# EasyEDA Pro project ProPrj_ETHlink8xADC_2025-03-31.epro, schematic ETHlink8xADC_Schematic, sheets 1 to 5 of 13

## Sheets
1 PSU: Board Name: ETHlink8xADC; Create Date: 2024-06-26; Page Name: PSU; Project Name: ETHlink8in; Schematic Name: ETHlink8xADC_Schematic; Update Date: 2024-06-27; Company: EasyEDA.com; Drawn: Eugenio Mancini; Page Size: A4; Part Number: JLCPCB-002; Reviewed: EasyEDA; Version: V1.0
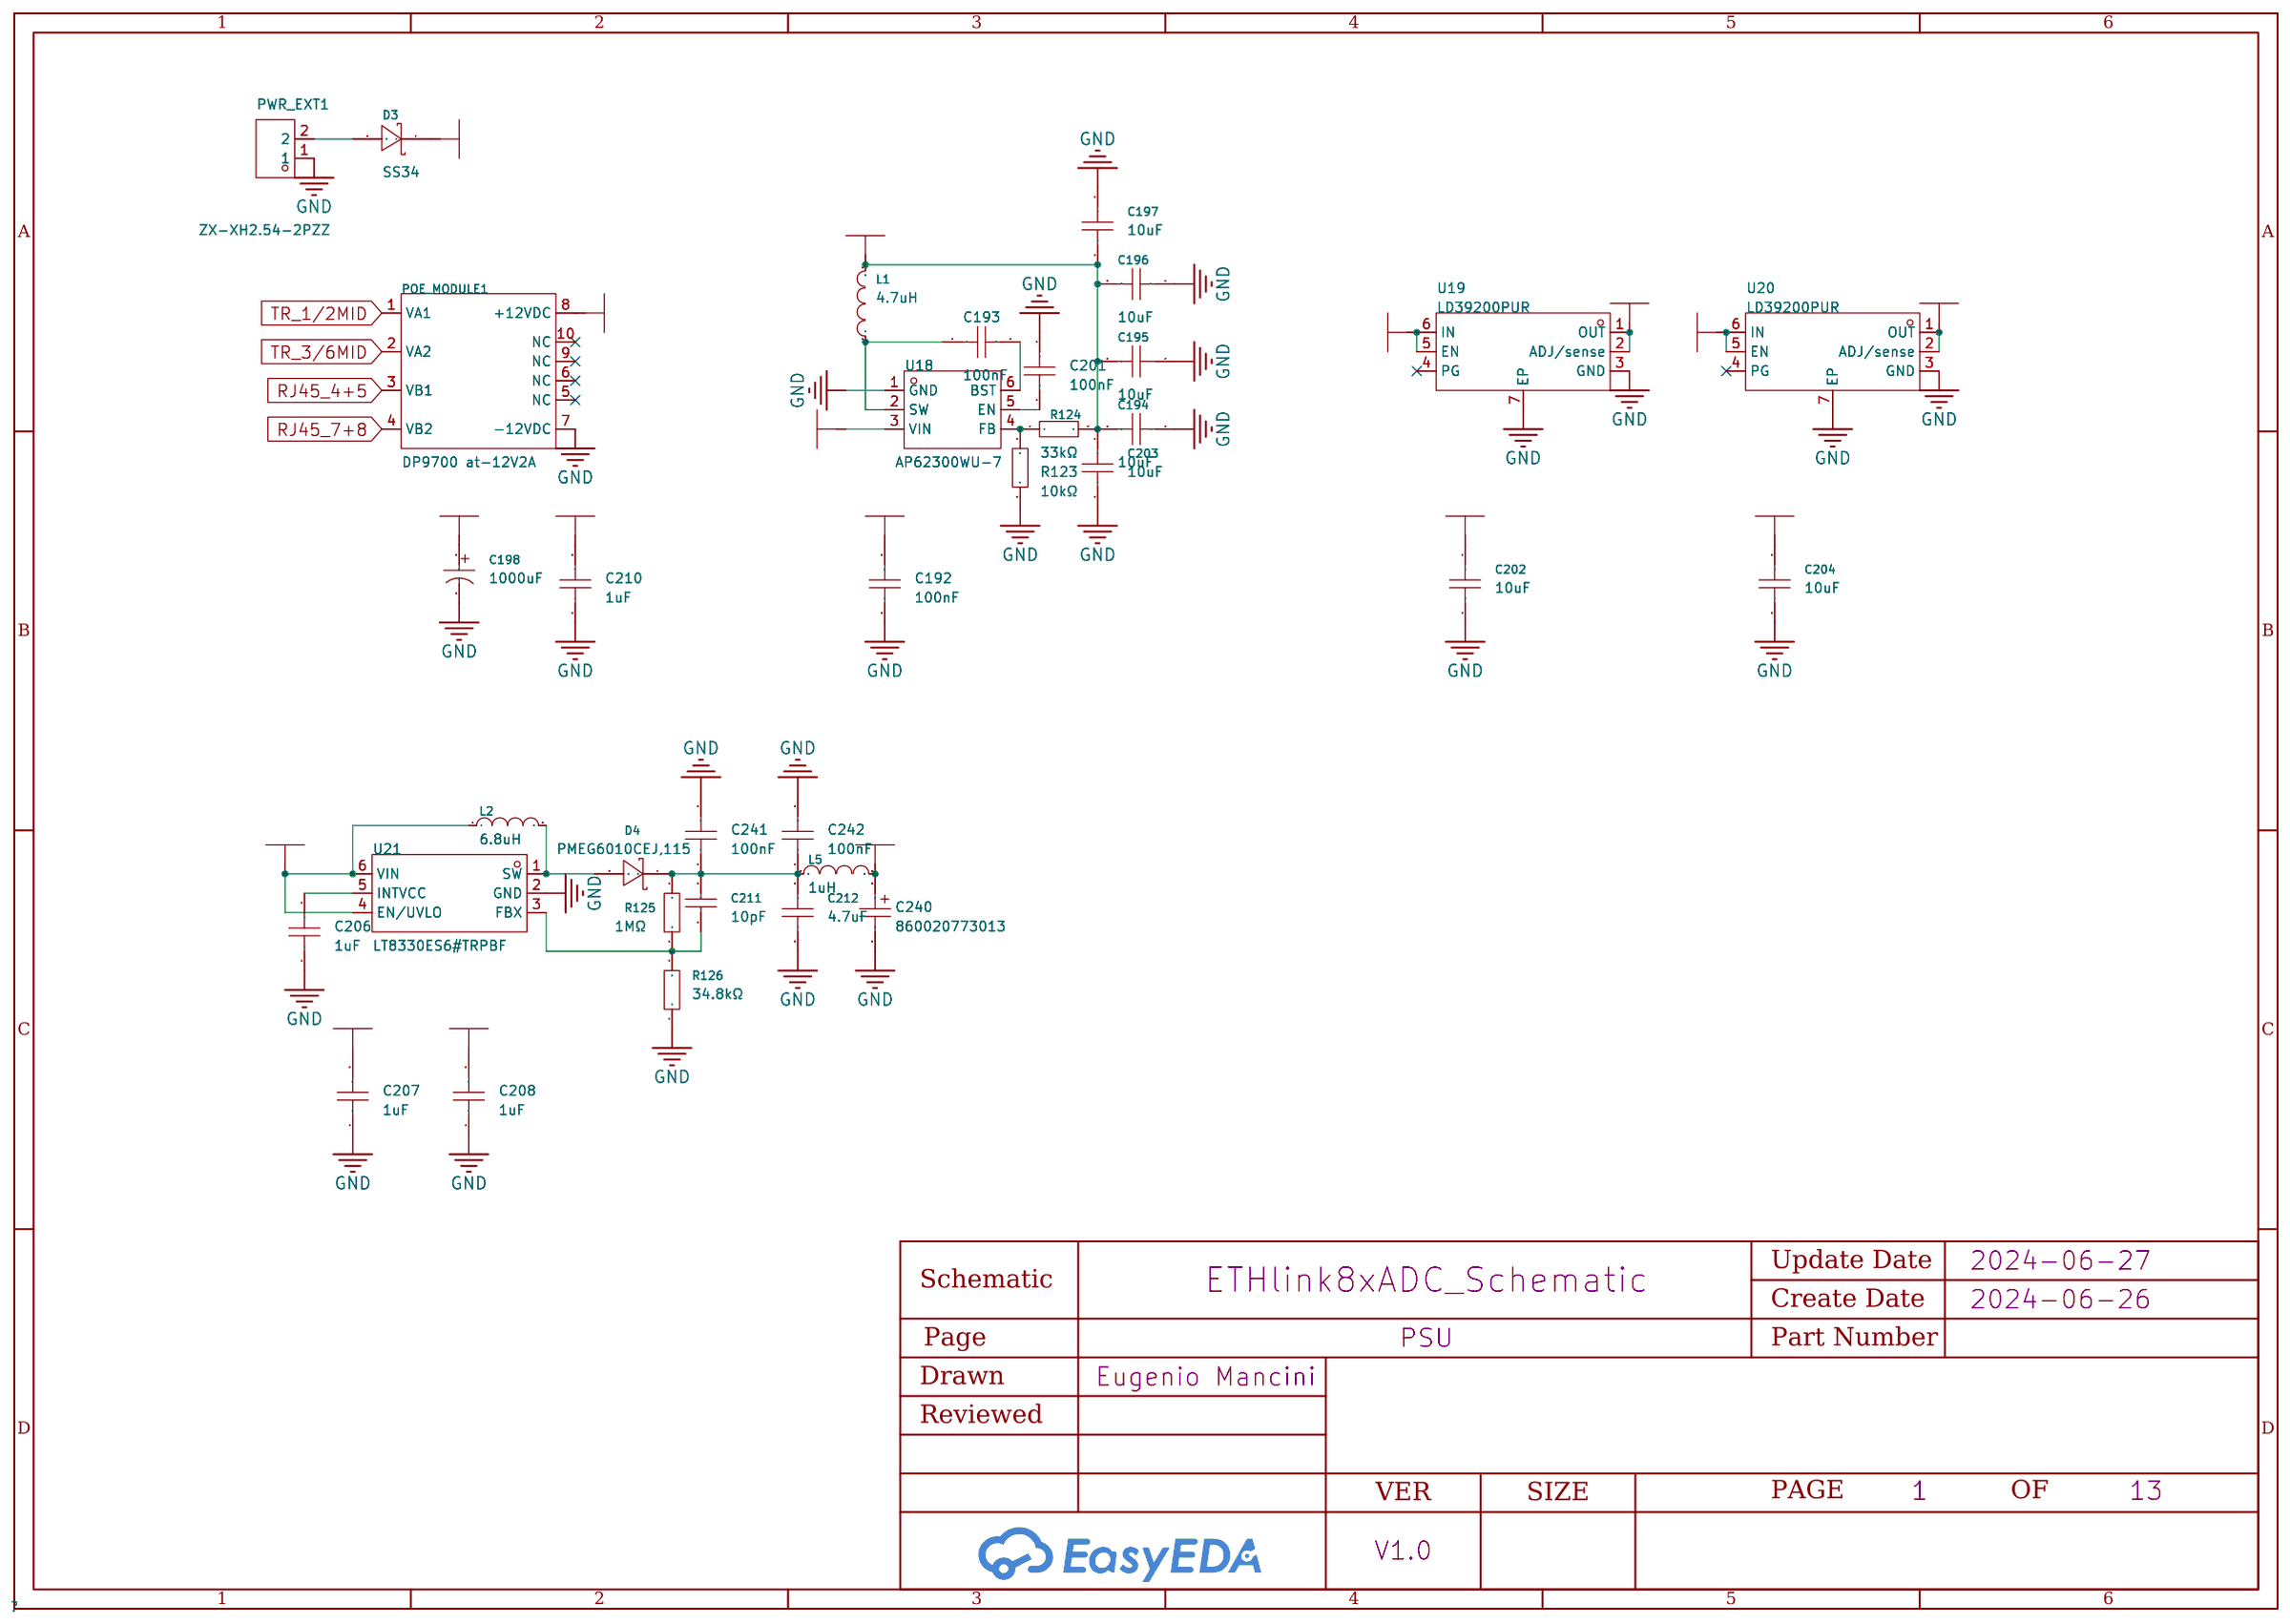
[diagram p0: PSU]
2 MCU: Page Name: MCU; Update Date: 2025-03-01
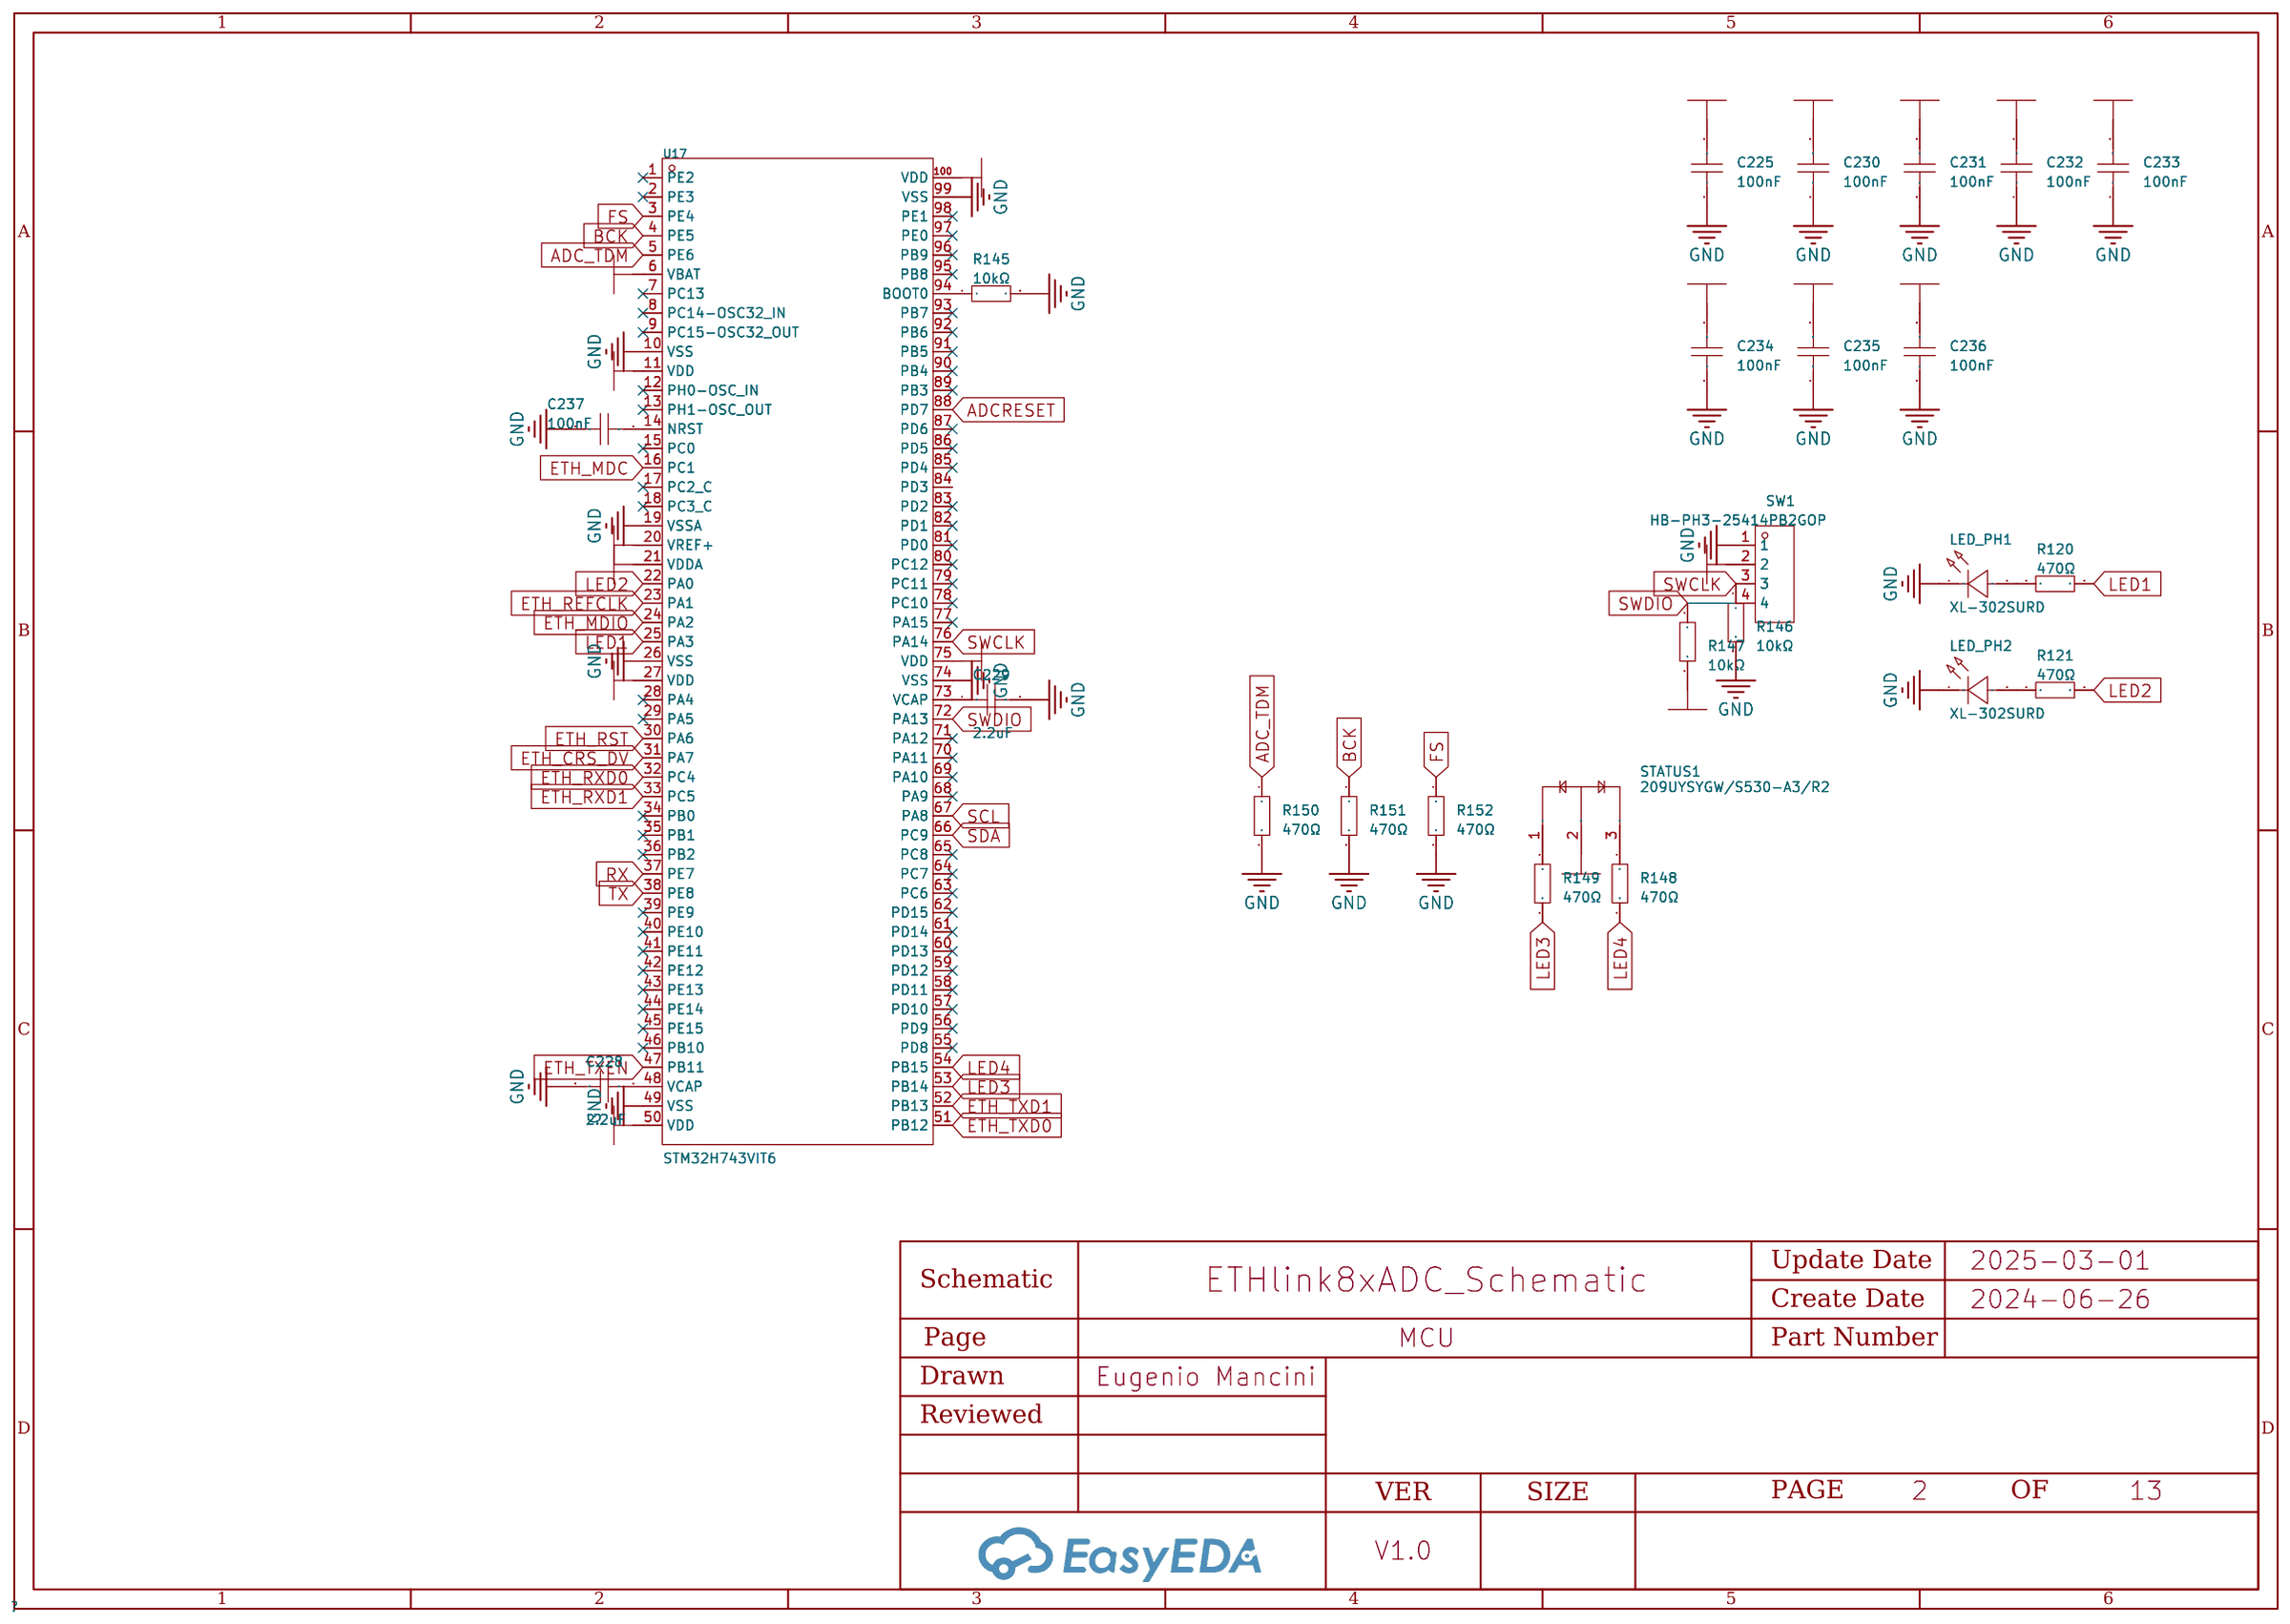
[diagram p1: MCU]
3 ETHERNET_PHY: Page Name: ETHERNET_PHY; Update Date: 2025-03-01; Drawn: EasyEDA; Version: V0.1
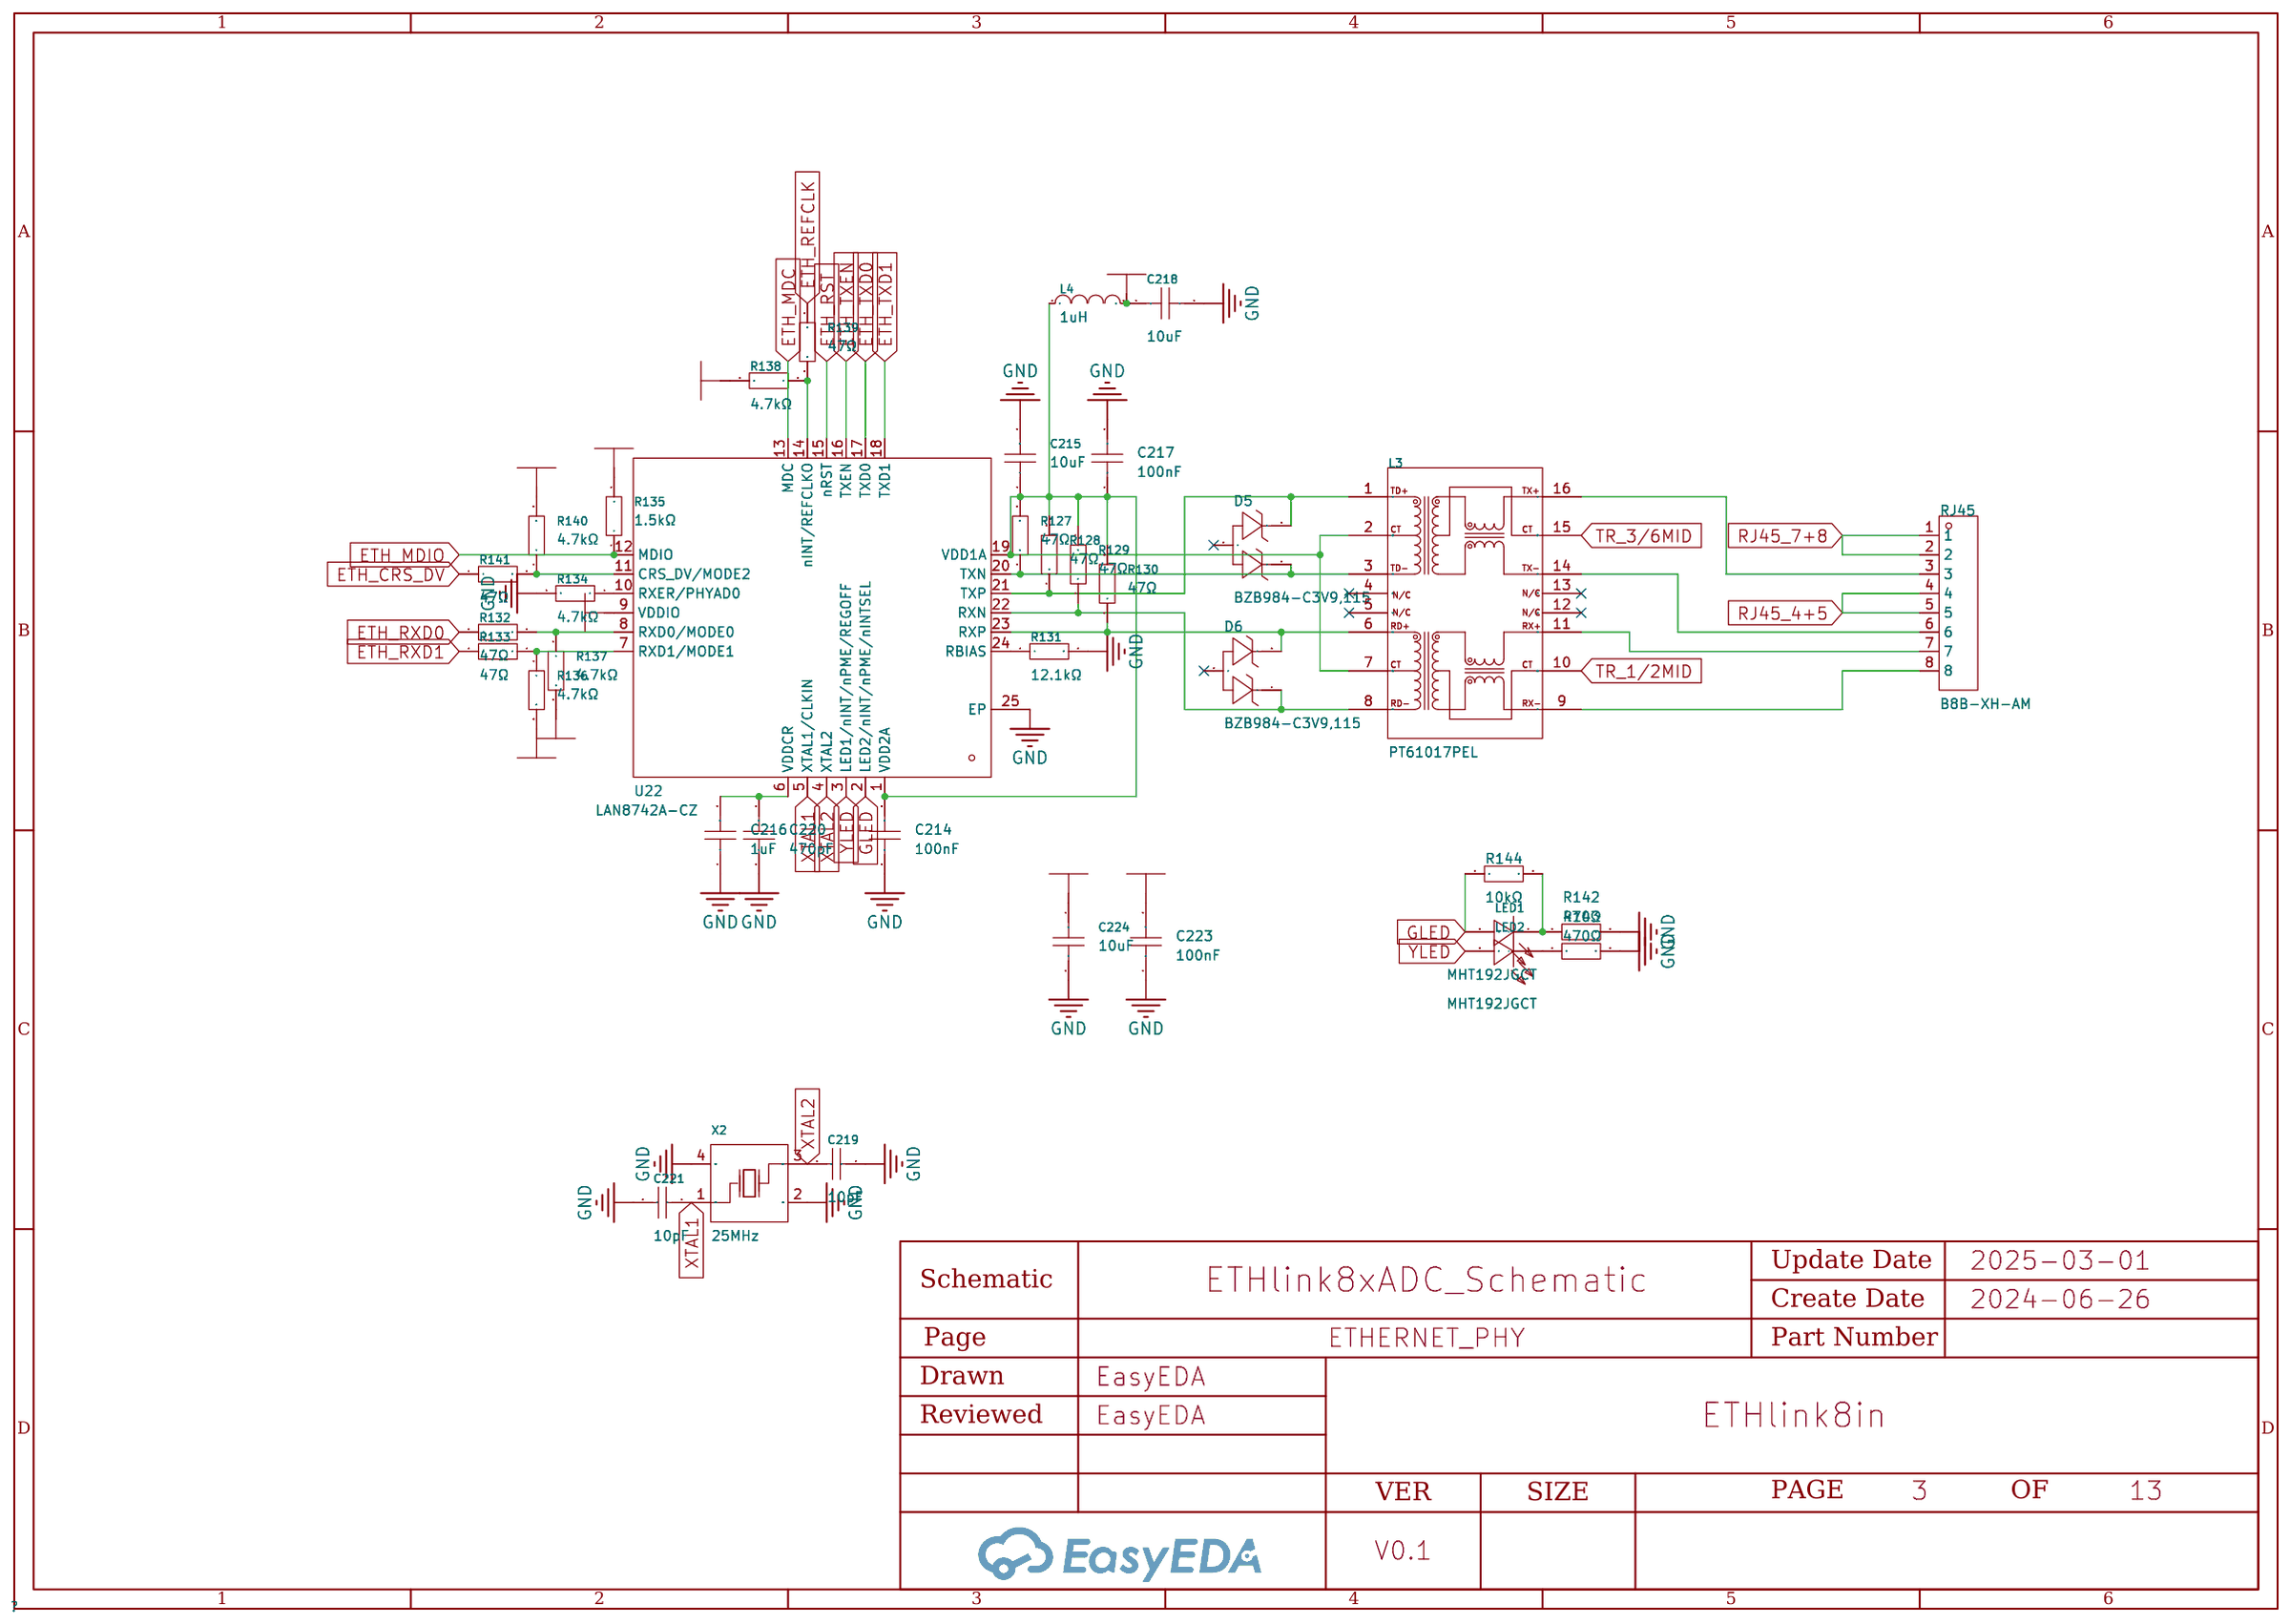
[diagram p2: ETHERNET_PHY]
4 CLOCK: Page Name: CLOCK; Schematic Name: Schematic1; Drawn: EasyEDA; Version: V0.1
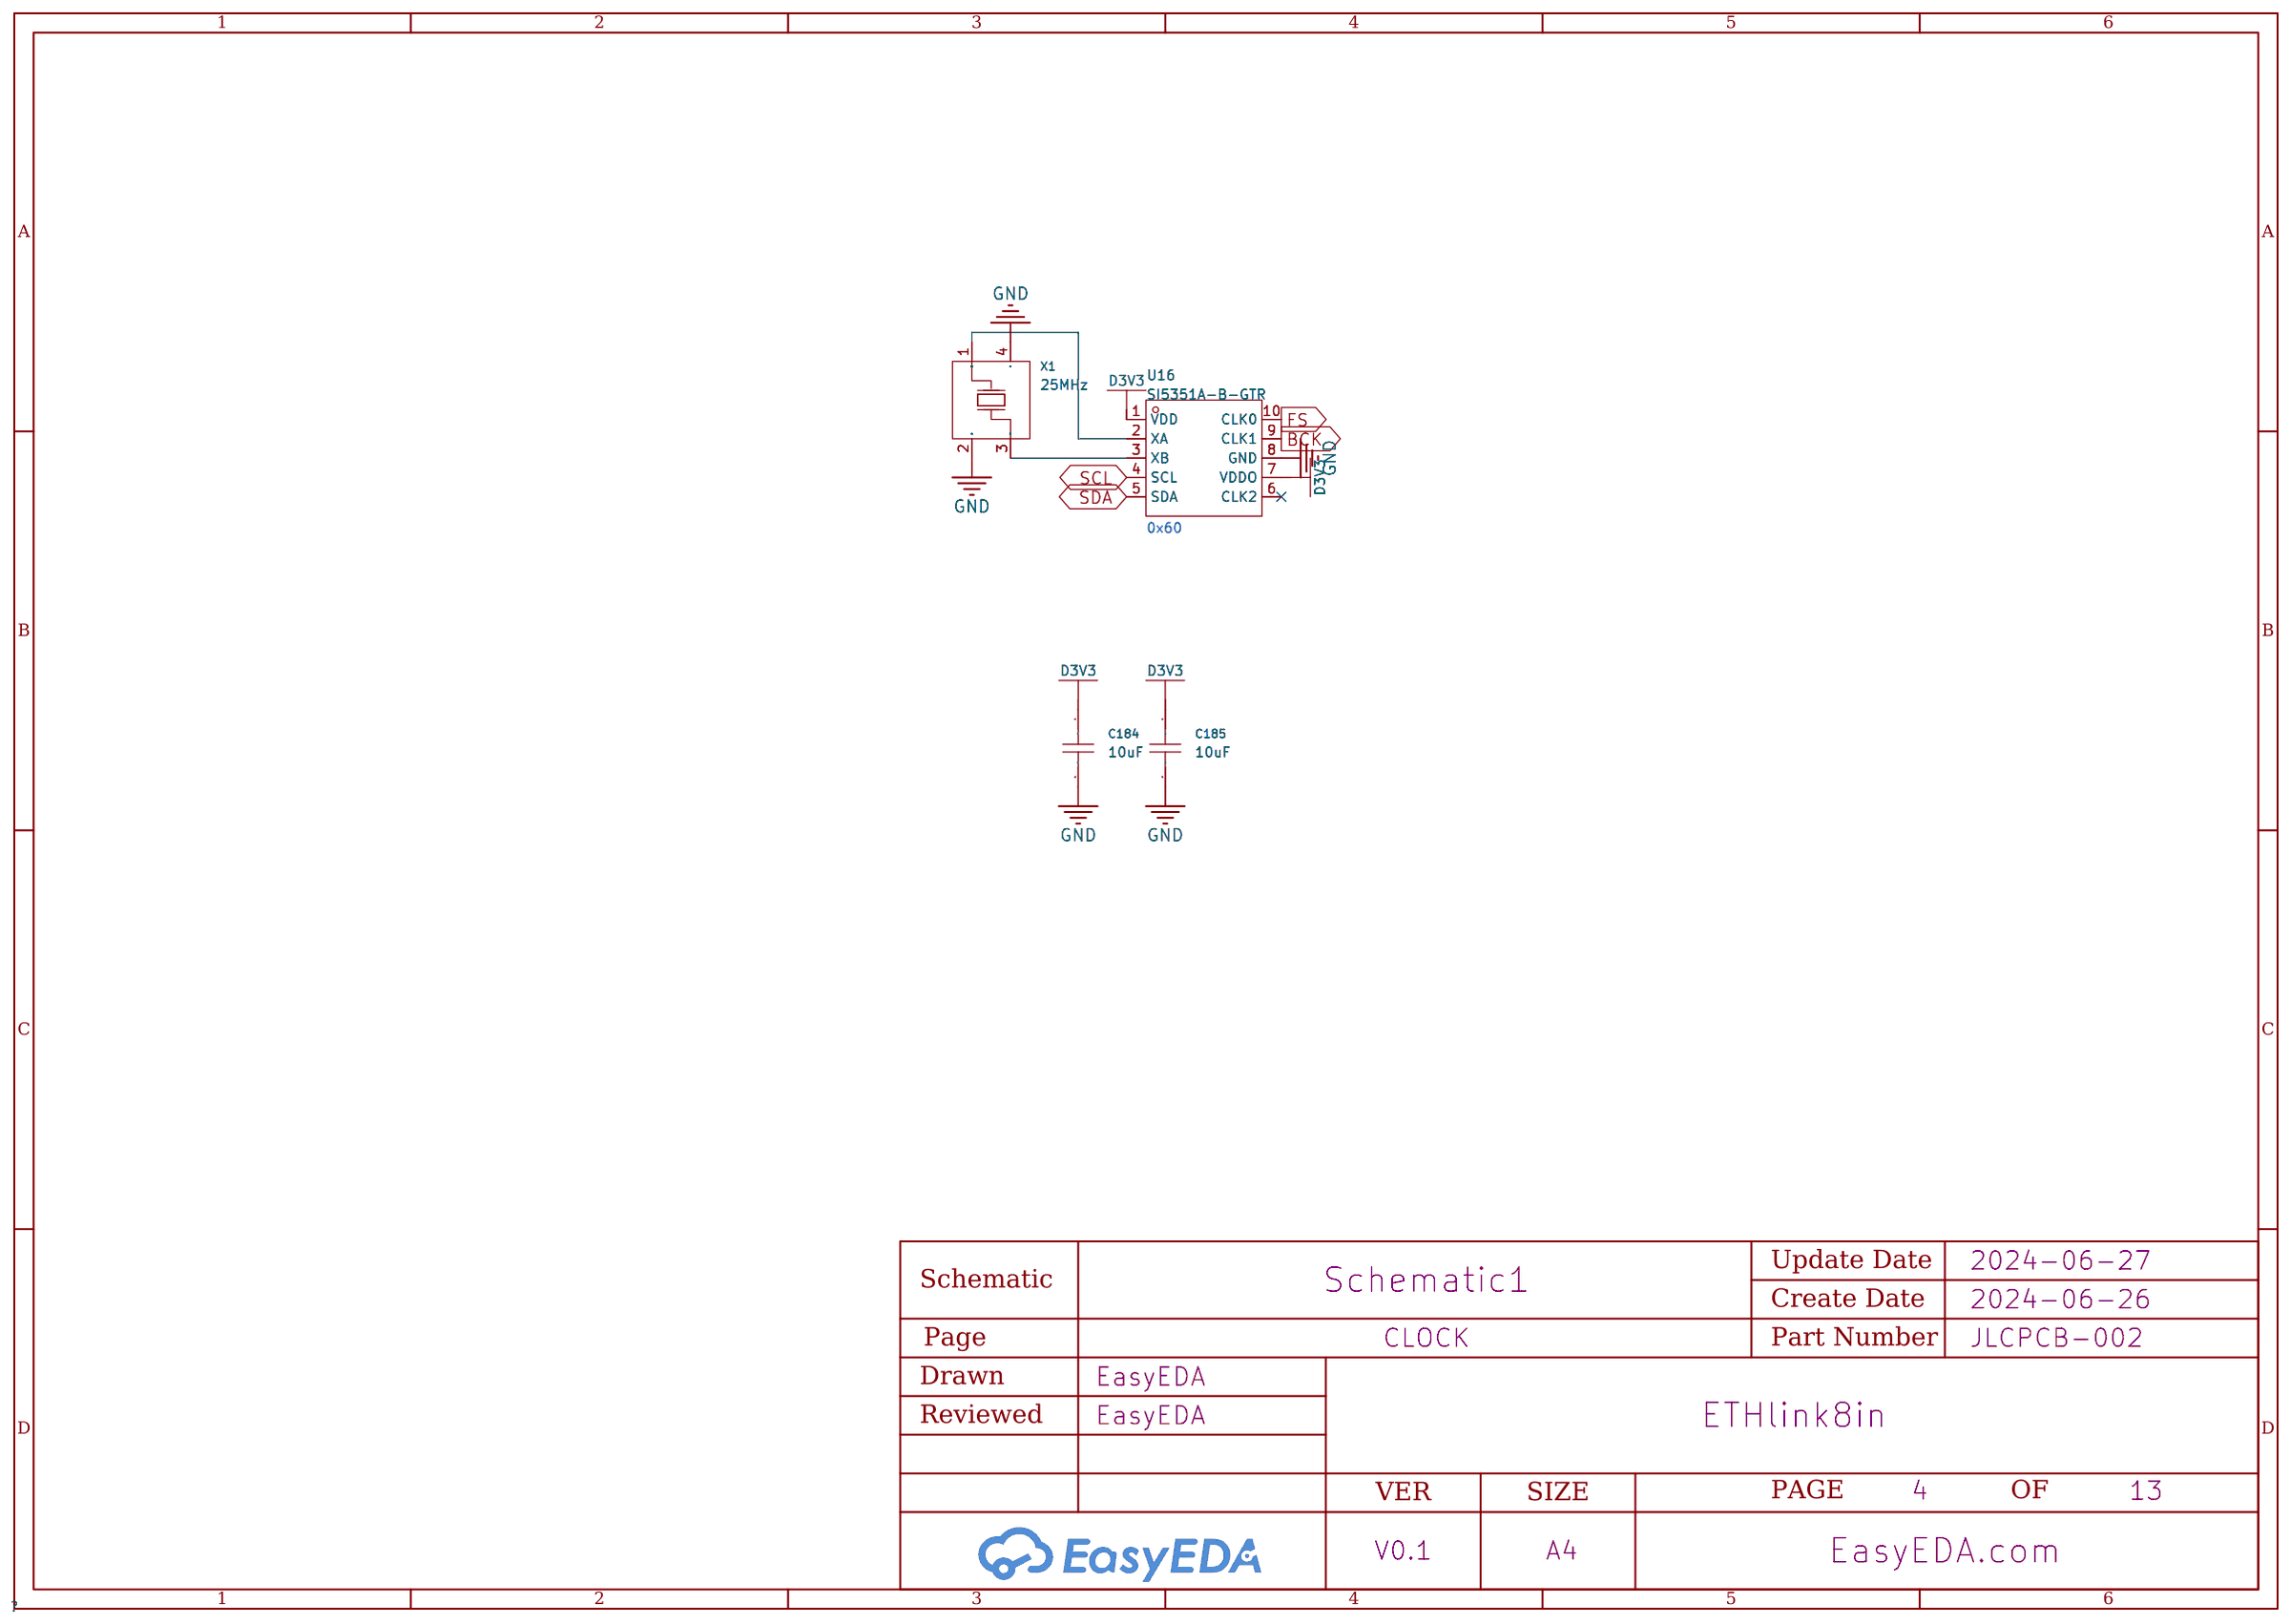
[diagram p3: CLOCK]
5 Preamp CH_1: Create Date: 2024-06-27; Page Name: Preamp CH_1; Schematic Name: Schematic1; Company: EMinc.; Part Number: 001; Reviewed: Eugenio Mancini; Version: V0.1
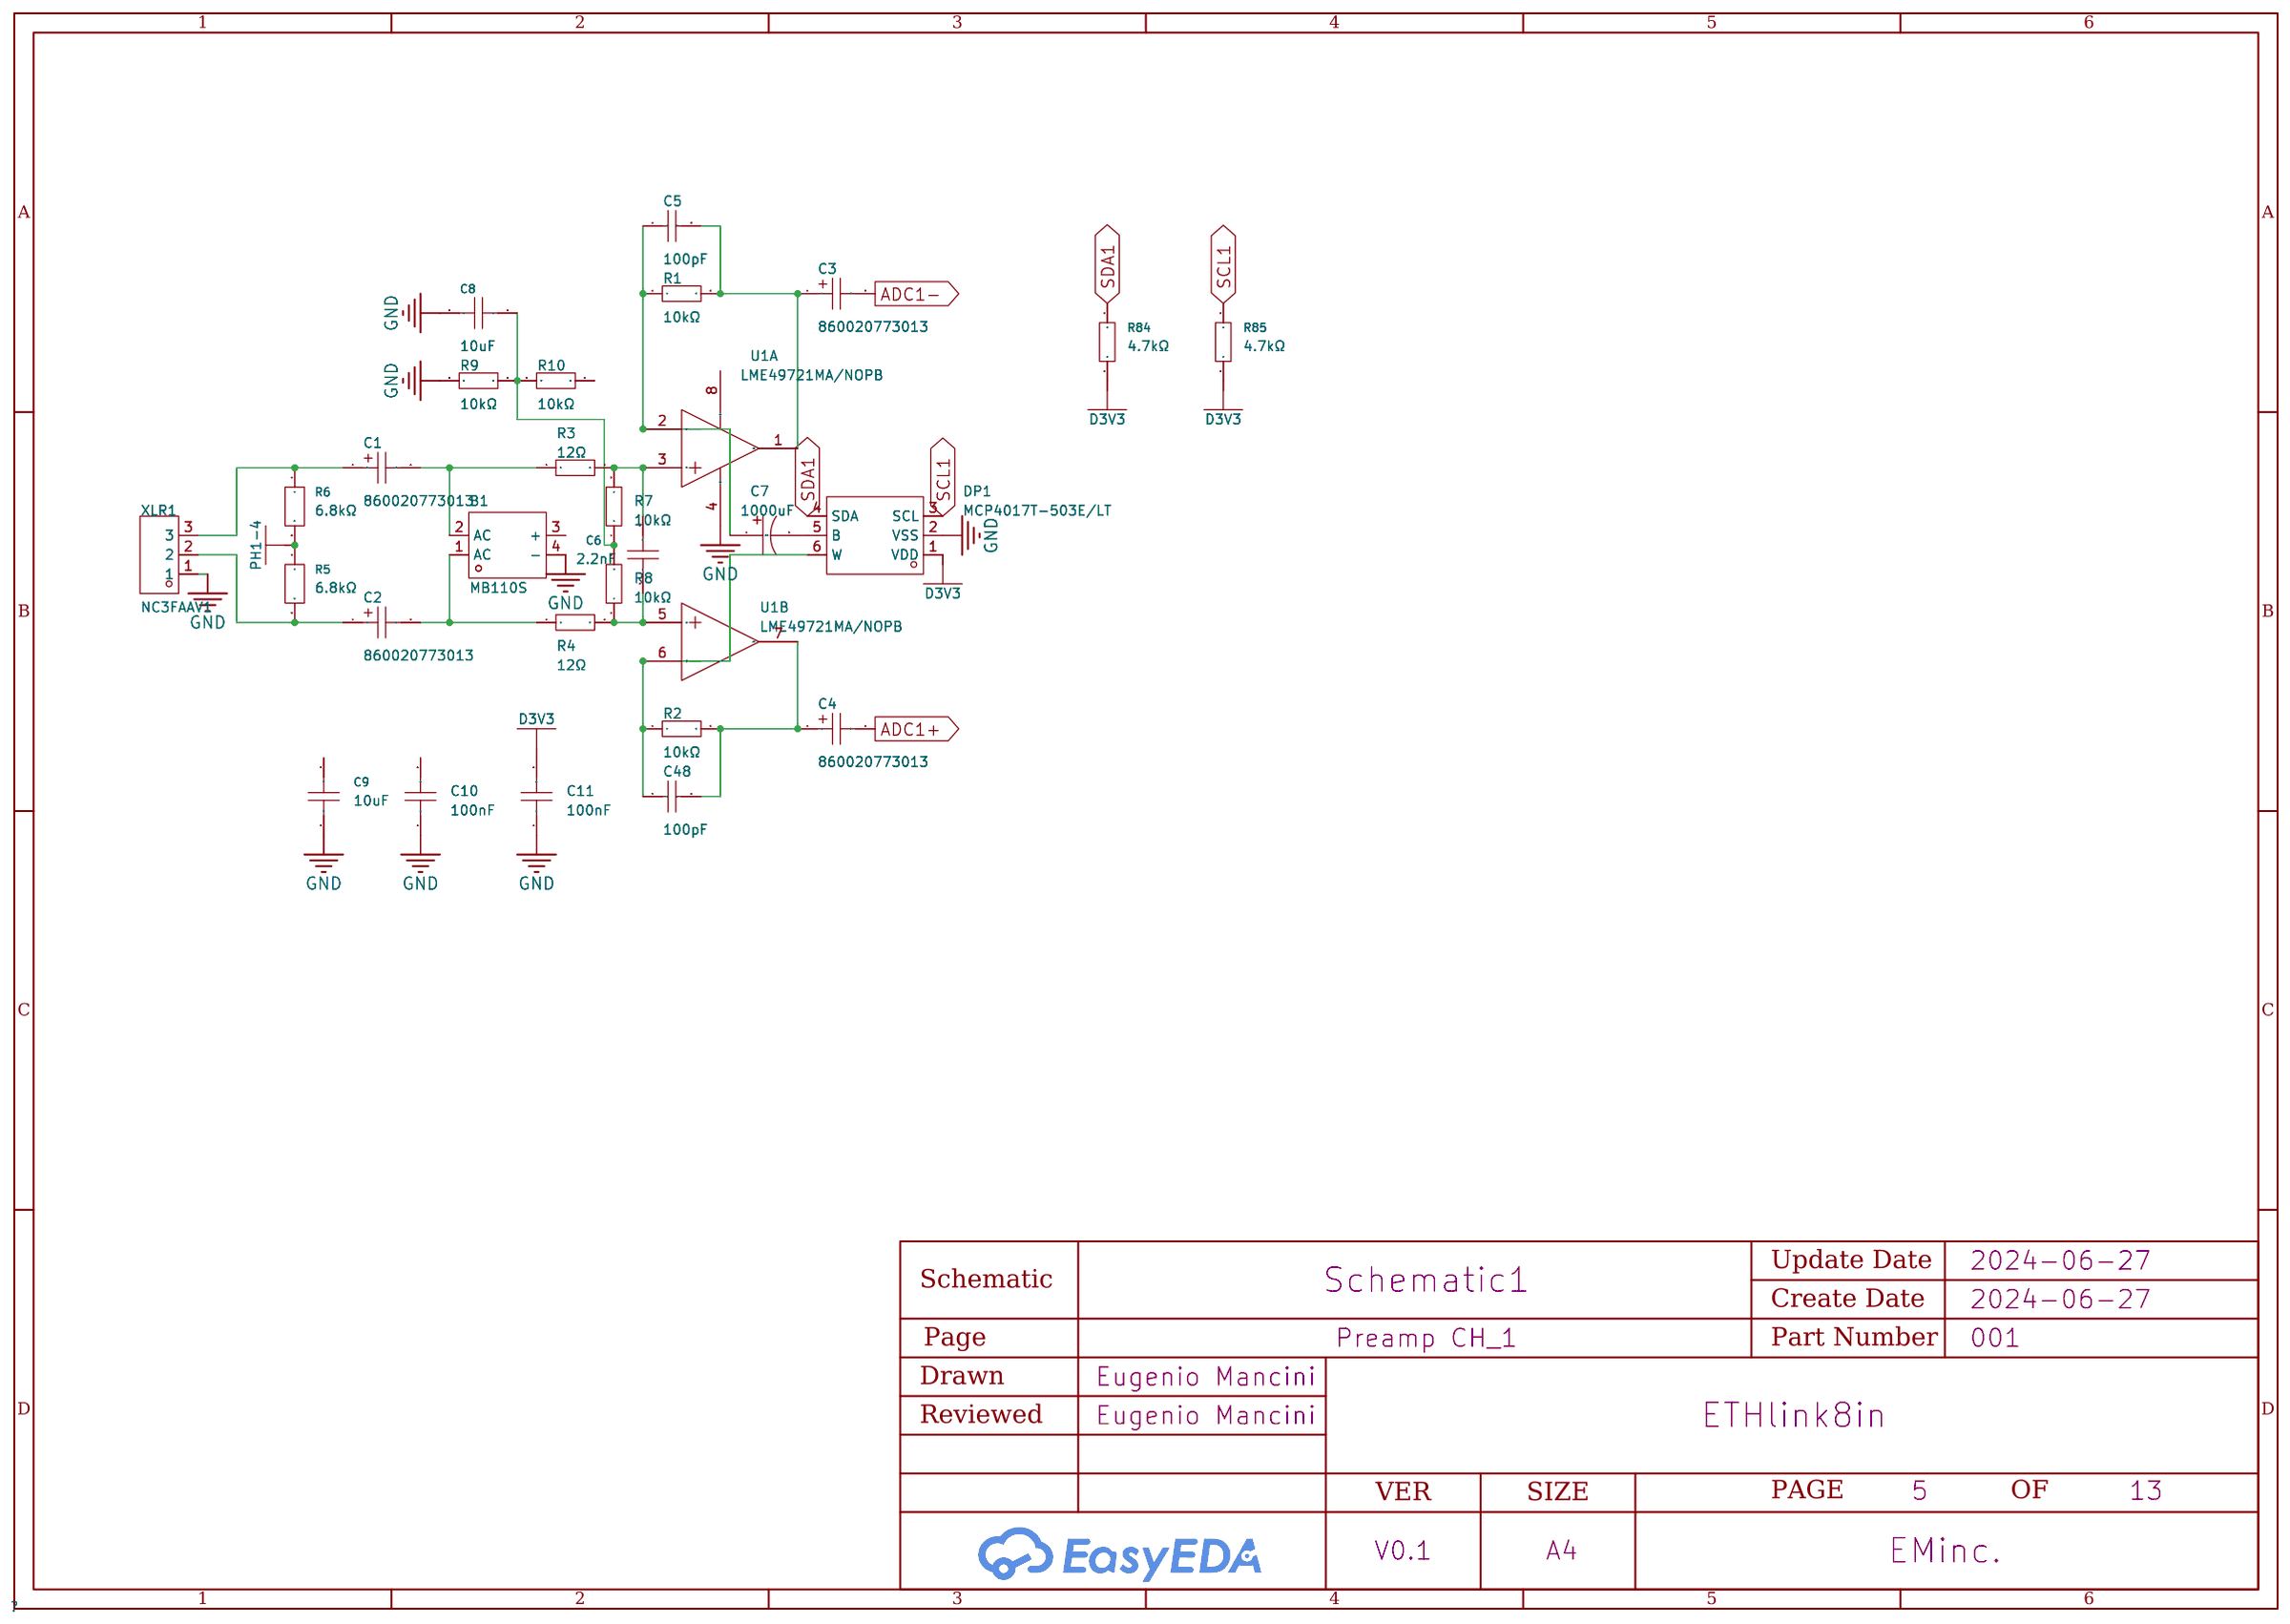
[diagram p4: Preamp CH_1]

## Parts
sheet CLOCK
C184  10uF  [C0603]
C185  10uF  [C0603]
U16  SI5351A-B-GTR  [MSOP-10_L3.0-W3.0-P0.50-LS5.0-BL]
X1  25MHz  [CRYSTAL-SMD_4P-L3.2-W2.5-BL]
sheet ETHERNET_PHY
C214  100nF  [C0603]
C215  10uF  [C0603]
C216  1uF  [C0603]
C217  100nF  [C0603]
C218  10uF  [C0603]
C219  10pF  [C0603]
C220  470pF  [C0603]
C221  10pF  [C0603]
C223  100nF  [C0603]
C224  10uF  [C0603]
D5  BZB984-C3V9,115  [SOT-663-3_L1.6-W1.2-P1.00-LS1.6-BR]
D6  BZB984-C3V9,115  [SOT-663-3_L1.6-W1.2-P1.00-LS1.6-BR]
L3  PT61017PEL  [XFMR-SMD_PT61017PEL]
L4  1uH  [L1008]
LED1  MHT192JGCT  [LED0603-RD]
LED2  MHT192JGCT  [LED0603-RD]
R127  47Ω  [R0603]
R128  47Ω  [R0603]
R129  47Ω  [R0603]
R130  47Ω  [R0603]
R131  12.1kΩ  [R0603]
R132  47Ω  [R0603]
R133  47Ω  [R0603]
R134  4.7kΩ  [R0603]
R135  1.5kΩ  [R0603]
R136  4.7kΩ  [R0603]
R137  4.7kΩ  [R0603]
R138  4.7kΩ  [R0603]
R139  47Ω  [R0603]
R140  4.7kΩ  [R0603]
R141  47Ω  [R0603]
R142  470Ω  [R0603]
R143  470Ω  [R0603]
R144  10kΩ  [R0603]
RJ45  B8B-XH-AM  [CONN-TH_8P-P2.50_B8B-XH-AM-LF-SN]
U22  LAN8742A-CZ  [QFN-24_L4.0-W4.0-P0.50-BL-EP2.6]
X2  25MHz  [CRYSTAL-SMD_4P-L3.2-W2.5-BL]
sheet MCU
C225  100nF  [C0603]
C228  2.2uF  [C0603]
C229  2.2uF  [C0603]
C230  100nF  [C0603]
C231  100nF  [C0603]
C232  100nF  [C0603]
C233  100nF  [C0603]
C234  100nF  [C0603]
C235  100nF  [C0603]
C236  100nF  [C0603]
C237  100nF  [C0603]
LED_PH1  XL-302SURD  [LED-TH_BD3.8-P2.54-RD]
LED_PH2  XL-302SURD  [LED-TH_BD3.8-P2.54-RD]
R120  470Ω  [R0603]
R121  470Ω  [R0603]
R145  10kΩ  [R0603]
R146  10kΩ  [R0603]
R147  10kΩ  [R0603]
R148  470Ω  [R0603]
R149  470Ω  [R0603]
R150  470Ω  [R0603]
R151  470Ω  [R0603]
R152  470Ω  [R0603]
STATUS1  209UYSYGW/S530-A3/R2  [LED-TH_3P-BD4.0-P2.54]
SW1  HB-PH3-25414PB2GOP  [HDR-TH_4P-P2.54-V-M]
U17  STM32H743VIT6  [LQFP-100_L14.0-W14.0-P0.50-LS16.0-BL]
sheet Preamp CH_1
B1  MB110S  [MBS_L4.7-W4.0-P2.50-LS7.0-TL]
C1  860020773013  [CAP-TH_BD6.3-P2.50-D0.5-FD]
C2  860020773013  [CAP-TH_BD6.3-P2.50-D0.5-FD]
C3  860020773013  [CAP-TH_BD6.3-P2.50-D0.5-FD]
C4  860020773013  [CAP-TH_BD6.3-P2.50-D0.5-FD]
C5  100pF  [C0603]
C6  2.2nF  [C0603]
C7  1000uF  [CAP-TH_BD8.0-P3.50-D0.6-FD-2]
C8  10uF  [C0603]
C9  10uF  [C0603]
C10  100nF  [C0603]
C11  100nF  [C0603]
C48  100pF  [C0603]
DP1  MCP4017T-503E/LT  [SC-70-6_L2.0-W1.3-P0.65-LS2.1-BL]
R1  10kΩ  [R0603]
R2  10kΩ  [R0603]
R3  12Ω  [R0603]
R4  12Ω  [R0603]
R5  6.8kΩ  [R0805]
R6  6.8kΩ  [R0805]
R7  10kΩ  [R0603]
R8  10kΩ  [R0603]
R9  10kΩ  [R0603]
R10  10kΩ  [R0603]
R84  4.7kΩ  [R0603]
R85  4.7kΩ  [R0603]
U1  LME49721MA/NOPB  [SOIC-8_L4.9-W3.9-P1.27-LS6.0-BL]  (sections 1,2)
XLR1  NC3FAAV1  [CONN-TH_NC3FAAV1]
sheet PSU
C192  100nF  [C0603]
C193  100nF  [C0603]
C194  10uF  [C0603]
C195  10uF  [C0603]
C196  10uF  [C0603]
C197  10uF  [C0603]
C198  1000uF  [CAP-TH_BD10.0-P5.00-D1.0-FD]
C201  100nF  [C0603]
C202  10uF  [C0603]
C203  10uF  [C0603]
C204  10uF  [C0603]
C206  1uF  [C0603]
C207  1uF  [C0603]
C208  1uF  [C0603]
C210  1uF  [C0603]
C211  10pF  [C0603]
C212  4.7uF  [C1210]
C240  860020773013  [CAP-TH_BD6.3-P2.50-D0.5-FD]
C241  100nF  [C0603]
C242  100nF  [C0603]
D3  SS34  [SMA_L4.3-W2.6-LS5.2-RD]
D4  PMEG6010CEJ,115  [SOD-323F_L2.0-W1.6-LS2.5-RD]
L1  4.7uH  [IND-SMD_L7.0-W6.6_0630CDMCCDS]
L2  6.8uH  [IND-SMD_L7.3-W6.6]
L5  1uH  [L1008]
POE_MODULE1  DP9700 at-12V2A  [PWRM-TH_DP9700-XX]
PWR_EXT1  ZX-XH2.54-2PZZ  [CONN-TH_2P-P2.50_HX25003-2A]
R123  10kΩ  [R0603]
R124  33kΩ  [R0603]
R125  1MΩ  [R0603]
R126  34.8kΩ  [R0603]
U18  AP62300WU-7  [TSOT-23-6_L2.9-W1.6-P0.95-LS2.8-BL]
U19  LD39200PUR  [DFN-6_L3.0-W3.0-P0.95-BL-EP-1]
U20  LD39200PUR  [DFN-6_L3.0-W3.0-P0.95-BL-EP-1]
U21  LT8330ES6#TRPBF  [TSOT-23-6_L2.9-W1.6-P0.95-LS2.8-BR]

## Library data of the parts
C8 C9 C184 C185 C194-C197 C202-C204 C215 C218 C224 = CL10A106MQ8NNNC: Capacitance: Tolerance:±20% Tolerance:±20% Voltage Rated: Temperature Coefficient:; LCSC Part Name: 10uF ±20% 6.3V; Supplier Part: C1691; Manufacturer: SAMSUNG(三星); Supplier Footprint: 0603; JLCPCB Part Class: Extended Part; Datasheet: https://atta.szlcsc.com/upload/public/pdf/source/20160218/1457707763339.pdf; Supplier: LCSC; Tolerance: ±20%
U16 = SI5351A-B-GTR: Interface:I2C Output Frequency (Max):200MHz Supply Voltage:2.25V~3.6V Supply Voltage:2.25V~3.6V Input Low Voltage:990mV Input Low Voltage:990mV Intput High Voltage:1.75V~3.6V Intput High Voltage:1.75V~3.6V Output Low Voltage:600mV Output Low Voltage:600mV; Supplier Part: C504891; Manufacturer: SKYWORKS/SILICON LABS(芯科); Supplier Footprint: MSOP-10; JLCPCB Part Class: Extended Part; Datasheet: https://atta.szlcsc.com/upload/public/pdf/source/20201217/C504891_43D9F8D26F790B9DA481E85A362B0988.pdf; Supplier: LCSC; Interface: I2C; Output Frequency (Max): 200MHz; Supply Voltage: 2.25V~3.6V; Input Low Voltage: 990mV; Intput High Voltage: 1.75V~3.6V; Output Low Voltage: 600mV; Output High Voltage: 1.9V; Operating Temperatue: -55℃~+150℃
X1 X2 = 7M-25.000MEEQ-T: Frequency:25MHz Normal temperature Frequency Tolerance:±10ppm Normal temperature Frequency Tolerance:±10ppm External load capacitor: Frequency Stability(Full temperature range):±10ppm Frequency Stability(Full temperature range):±10ppm Equivalent Series Re; LCSC Part Name: 25MHz ±10ppm 10pF; Supplier Part: C2450106; Manufacturer: TXC(晶技); Supplier Footprint: SMD3225-4P; JLCPCB Part Class: Extended Part; Datasheet: https://atta.szlcsc.com/upload/public/pdf/source/20211127/6EE84679934CC9A5D3E8ADDAA8A476F2.pdf; Supplier: LCSC; Normal temperature Frequency Tolerance: ±10ppm; Frequency Stability(Full temperature range): ±10ppm; Equivalent Series Resistance (ESR): 60Ω
C10 C11 C192 C193 C201 C214 C217 C223 C225 C230-C237 C241 C242 = CL10B104KC8NNNC: Capacitance: Tolerance:±10% Tolerance:±10% Voltage Rated: Temperature Coefficient:; LCSC Part Name: 100nF ±10% 100V; Supplier Part: C15725; Manufacturer: SAMSUNG(三星); Supplier Footprint: 0603; JLCPCB Part Class: Extended Part; Datasheet: https://atta.szlcsc.com/upload/public/pdf/source/20160218/1457707763339.pdf; Supplier: LCSC; Tolerance: ±10%
C206-C208 C210 C216 = CL10A105KB8NNNC: Capacitance: Tolerance:±10% Tolerance:±10% Voltage Rated: Temperature Coefficient:; LCSC Part Name: 1uF ±10% 50V; Supplier Part: C15849; Manufacturer: SAMSUNG(三星); Supplier Footprint: 0603; JLCPCB Part Class: Basic Part; Datasheet: https://atta.szlcsc.com/upload/public/pdf/source/20160218/1457707763339.pdf; Supplier: LCSC; Tolerance: ±10%
C211 C219 C221 = CL10C100JB8NNNC: Capacitance: Tolerance:±5% Tolerance:±5% Voltage Rated: Temperature Coefficient:; LCSC Part Name: 10pF ±5% 50V; Supplier Part: C1634; Manufacturer: SAMSUNG(三星); Supplier Footprint: 0603; JLCPCB Part Class: Basic Part; Datasheet: https://atta.szlcsc.com/upload/public/pdf/source/20160218/1457707763339.pdf; Supplier: LCSC; Tolerance: ±5%
C220 = CL10C471JC8NNNC: Capacitance: Tolerance:±5% Tolerance:±5% Voltage Rated: Temperature Coefficient:; LCSC Part Name: 470pF ±5% 100V; Supplier Part: C525649; Manufacturer: SAMSUNG(三星); Supplier Footprint: 0603; JLCPCB Part Class: Extended Part; Datasheet: https://atta.szlcsc.com/upload/public/pdf/source/20160218/1457707763339.pdf; Supplier: LCSC; Tolerance: ±5%
D5 D6 = BZB984-C3V9,115: Diode Configuration:1对共阳极 Zener Voltage (Nom):3.9V Reverse Leakage Current (Ir):3uA@1V Power Dissipation:265mW Zener Impedance (Zzt):85Ω Tolerance:±5% Tolerance:±5%; Supplier Part: C550162; Manufacturer: Nexperia(安世); Supplier Footprint: SOT-663-3; JLCPCB Part Class: Extended Part; Datasheet: https://atta.szlcsc.com/upload/public/pdf/source/20191009/C435878_74042F1C3A1E16EF94A0AC2109F82809.pdf; Supplier: LCSC; Diode Configuration: 1对共阳极; Zener Voltage (Nom): 3.9V; Reverse Leakage Current (Ir): 3uA@1V; Power Dissipation: 265mW; Zener Impedance (Zzt): 85Ω; Tolerance: ±5%
L3 = PT61017PEL: Turns Ratio:1CT:1CT Inductor:350uH operating temperature:0℃~+70℃ operating temperature:0℃~+70℃; Supplier Part: C124001; Manufacturer: BOURNS; Supplier Footprint: SMD,12.8x6.9mm; JLCPCB Part Class: Extended Part; Datasheet: https://atta.szlcsc.com/upload/public/pdf/source/20170810/C124001_1502335220058879754.pdf; Supplier: LCSC; Turns Ratio: 1CT:1CT; Inductor: 350uH; operating temperature: 0℃~+70℃
L4 L5 = LQM2HPN1R0MGHL: Inductance: Tolerance:±20% Tolerance:±20% Rated Current: Saturation Current (Isat): DC Resistance (DCR): Q @ Freq:- Frequency - Self Resonant: Ratings: Type:叠层电感; LCSC Part Name: 1uH ±20% 2A; Supplier Part: C162587; Manufacturer: muRata(村田); Supplier Footprint: 1008; JLCPCB Part Class: Extended Part; Datasheet: https://atta.szlcsc.com/upload/public/pdf/source/20190724/C171762_9C8CF7B0694612DCE2545660DA2A3B9B.pdf; Supplier: LCSC; Tolerance: ±20%; Type: 叠层电感
LED1 LED2 = MHT192JGCT: Emitted Color:Green-yellow Power Dissipation:60mW Forward Current:5mA Dominant Wavelength:572nm Dominant Wavelength:572nm Peak Wavelength:571nm Diode Configuration:- Lens Color:无色透明透镜 Color Temperature:- Color Temperature:- Viewing Angle:120° Mounting Syt; LCSC Part Name: 普绿/黄绿; Supplier Part: C473820; Manufacturer: MEIHUA(美华); Supplier Footprint: 0603; JLCPCB Part Class: Extended Part; Datasheet: https://atta.szlcsc.com/upload/public/pdf/source/20191226/C473820_92F66B1E2C08E6ED06F9017989DCEAB5.pdf; Supplier: LCSC; Emitted Color: Green-yellow; Power Dissipation: 60mW; Forward Current: 5mA; Dominant Wavelength: 572nm; Peak Wavelength: 571nm; Lens Color: 无色透明透镜; Viewing Angle: 120°; Operating Temperature: -40℃~+85℃
R127-R130 R132 R133 R139 R141 = 0603WAF470JT5E: Type:Thick Film Resistors Resistance:47Ω Tolerance:±1% Tolerance:±1% Power(Watts): Overload Voltage (Max): Temperature Coefficient:±100ppm/℃ Temperature Coefficient:±100ppm/℃ Operating Temperature Range:-55℃~+155℃ Operating Temperature Range:-55℃~+155℃; LCSC Part Name: 47Ω ±1% 100mW 厚膜电阻; Supplier Part: C23182; Manufacturer: UNI-ROYAL(厚声); Supplier Footprint: 0603; JLCPCB Part Class: Basic Part; Datasheet: https://atta.szlcsc.com/upload/public/pdf/source/20200306/C422600_1E6D84923E4A46A82E41ADD87F860B5C.pdf; Supplier: LCSC; Type: Thick Film Resistors; Tolerance: ±1%; Temperature Coefficient: ±100ppm/℃; Operating Temperature Range: -55℃~+155℃
R131 = 0603WAF1212T5E: Type:Thick Film Resistors Resistance:12.1kΩ Tolerance:±1% Tolerance:±1% Power(Watts): Overload Voltage (Max): Temperature Coefficient:±100ppm/℃ Temperature Coefficient:±100ppm/℃ Operating Temperature Range:-55℃~+155℃ Operating Temperature Range:-55℃~+155℃; LCSC Part Name: 12.1kΩ ±1% 100mW 厚膜电阻; Supplier Part: C22864; Manufacturer: UNI-ROYAL(厚声); Supplier Footprint: 0603; JLCPCB Part Class: Extended Part; Datasheet: https://atta.szlcsc.com/upload/public/pdf/source/20200306/C422600_1E6D84923E4A46A82E41ADD87F860B5C.pdf; Supplier: LCSC; Type: Thick Film Resistors; Tolerance: ±1%; Temperature Coefficient: ±100ppm/℃; Operating Temperature Range: -55℃~+155℃
R84 R85 R134 R136-R138 R140 = 0603WAF4701T5E: Type:Thick Film Resistors Resistance:4.7kΩ Tolerance:±1% Tolerance:±1% Power(Watts): Overload Voltage (Max): Temperature Coefficient:±100ppm/℃ Temperature Coefficient:±100ppm/℃ Operating Temperature Range:-55℃~+155℃ Operating Temperature Range:-55℃~+155℃; LCSC Part Name: 4.7kΩ ±1% 100mW 厚膜电阻; Supplier Part: C23162; Manufacturer: UNI-ROYAL(厚声); Supplier Footprint: 0603; JLCPCB Part Class: Basic Part; Datasheet: https://atta.szlcsc.com/upload/public/pdf/source/20200306/C422600_1E6D84923E4A46A82E41ADD87F860B5C.pdf; Supplier: LCSC; Type: Thick Film Resistors; Tolerance: ±1%; Temperature Coefficient: ±100ppm/℃; Operating Temperature Range: -55℃~+155℃
R135 = 0603WAF1501T5E: Type:Thick Film Resistors Resistance:1.5kΩ Tolerance:±1% Tolerance:±1% Power(Watts): Overload Voltage (Max): Temperature Coefficient:±100ppm/℃ Temperature Coefficient:±100ppm/℃ Operating Temperature Range:-55℃~+155℃ Operating Temperature Range:-55℃~+155℃; LCSC Part Name: 1.5kΩ ±1% 100mW 厚膜电阻; Supplier Part: C22843; Manufacturer: UNI-ROYAL(厚声); Supplier Footprint: 0603; JLCPCB Part Class: Basic Part; Datasheet: https://atta.szlcsc.com/upload/public/pdf/source/20200306/C422600_1E6D84923E4A46A82E41ADD87F860B5C.pdf; Supplier: LCSC; Type: Thick Film Resistors; Tolerance: ±1%; Temperature Coefficient: ±100ppm/℃; Operating Temperature Range: -55℃~+155℃
R120 R121 R142 R143 R148-R152 = 0603WAF4700T5E: Type:Thick Film Resistors Resistance: Tolerance:±1% Tolerance:±1% Power(Watts): Overload Voltage (Max): Temperature Coefficient:±100ppm/℃ Temperature Coefficient:±100ppm/℃ Operating Temperature Range:-55℃~+155℃ Operating Temperature Range:-55℃~+155℃; LCSC Part Name: 470Ω ±1% 100mW 厚膜电阻; Supplier Part: C23179; Manufacturer: UNI-ROYAL(厚声); Supplier Footprint: 0603; JLCPCB Part Class: Basic Part; Datasheet: https://atta.szlcsc.com/upload/public/pdf/source/20200306/C422600_1E6D84923E4A46A82E41ADD87F860B5C.pdf; Supplier: LCSC; Type: Thick Film Resistors; Tolerance: ±1%; Temperature Coefficient: ±100ppm/℃; Operating Temperature Range: -55℃~+155℃
R1 R2 R7-R10 R123 R144-R147 = RC0603FR-0710KL: Type:Thick Film Resistors Resistance: Tolerance:±1% Tolerance:±1% Power(Watts): Overload Voltage (Max): Temperature Coefficient:±100ppm/℃ Temperature Coefficient:±100ppm/℃ Operating Temperature Range:-55℃~+155℃ Operating Temperature Range:-55℃~+155℃; LCSC Part Name: 厚膜电阻 10kΩ ±1% 100mW; Supplier Part: C98220; Manufacturer: YAGEO(国巨); Supplier Footprint: 0603; JLCPCB Part Class: Extended Part; Datasheet: https://atta.szlcsc.com/upload/public/pdf/source/20180927/C295883_E8D83085EA81BD7DE0B2B681138C15EE.pdf; Supplier: LCSC; Type: Thick Film Resistors; Tolerance: ±1%; Temperature Coefficient: ±100ppm/℃; Operating Temperature Range: -55℃~+155℃
RJ45 = B8B-XH-AM: Pins Structure:1x8P Pitch:2.5mm Mounting Style:Straight Reference Series:XH Number of Pins:8P Number of Rows:1 Number of PINs Per Row:8 Row Spacing:- Current Rating (Max):3A Contact Material:Brass Contact Plating:Tin Operating Temperature Range:-25℃~+85℃; LCSC Part Name: 1x8P 间距:2.5mm 直插 系列:XH; Supplier Part: C5306535; Manufacturer: JST; Supplier Footprint: 插件; JLCPCB Part Class: Extended Part; Datasheet: https://atta.szlcsc.com/upload/public/pdf/source/20210915/55C2150F8D01CCBD7F61D7DC07E45ED6.pdf; Supplier: LCSC; Pins Structure: 1x8P; Pitch: 2.5mm; Mounting Style: Straight; Reference Series: XH; Number of Pins: 8P; Number of Rows: 1; Number of PINs Per Row: 8; Current Rating (Max): 3A; Contact Material: Brass; Contact Plating: Tin; Operating Temperature Range: -25℃~+85℃; Rated Voltage (Max): 250V; Plastic Material: PA66; Flame Retardant Rating: UL94V-0; Supplementary Features: 打K脚；带柱; Z-Height of the Board: 7mm; X-Length of Bottom Edge on Board (Spacing Line): 22.4mm; Y-Width of Bottom Edge on Board: 5.75mm
U22 = LAN8742A-CZ: Application Function: Number of Channels: Interface:; Supplier Part: C220794; Manufacturer: MICROCHIP(美国微芯); Supplier Footprint: QFN-24-EP(4x4); JLCPCB Part Class: Extended Part; Datasheet: https://atta.szlcsc.com/upload/public/pdf/source/20180530/C220794_9169BD3847B6C9AB12203128110311CE.pdf; Supplier: LCSC
C228 C229 = CL10A225KA8NNNC: Capacitance: Tolerance:±10% Tolerance:±10% Voltage Rated: Temperature Coefficient:; LCSC Part Name: 2.2uF ±10% 25V; Supplier Part: C57895; Manufacturer: SAMSUNG(三星); Supplier Footprint: 0603; JLCPCB Part Class: Extended Part; Datasheet: https://atta.szlcsc.com/upload/public/pdf/source/20160218/1457707763339.pdf; Supplier: LCSC; Tolerance: ±10%
LED_PH1 LED_PH2 = XL-302SURD: Lamp Holder Type:3mm圆形灯头 Emitted Color:Red Power Dissipation:80mW Forward Current:30mA Dominant Wavelength:615nm~620nm Dominant Wavelength:615nm~620nm Peak Wavelength:625nm Lens Color:红色透镜 Color Temperature:- Color Temperature:- Viewing Angle:50° Mounting; Supplier Part: C2895470; Manufacturer: XINGLIGHT(成兴光); Supplier Footprint: 插件,D=3mm; JLCPCB Part Class: Extended Part; Datasheet: https://atta.szlcsc.com/upload/public/pdf/source/20240112/E1E2B82945FD635E4907401DDE6D4922.pdf; Supplier: LCSC; Lamp Holder Type: 3mm圆形灯头; Emitted Color: Red; Power Dissipation: 80mW; Forward Current: 30mA; Dominant Wavelength: 615nm~620nm; Peak Wavelength: 625nm; Lens Color: 红色透镜; Viewing Angle: 50°; Operating Temperature: -25℃~+85℃
STATUS1 = 209UYSYGW/S530-A3/R2: Lamp Holder Type:3mm圆形灯头 Emitted Color:Yellow,Green-yellow Power Dissipation:60mW Forward Current:20mA Dominant Wavelength:573nm；589nm Dominant Wavelength:573nm；589nm Peak Wavelength:575nm；591nm Diode Configuration:Common anode Lens Color:雾状白透镜 Color Temp; LCSC Part Name: 黄灯,普绿/黄绿; Supplier Part: C409519; Manufacturer: EVERLIGHT(亿光); Supplier Footprint: 插件,D=3mm; JLCPCB Part Class: Extended Part; Datasheet: https://atta.szlcsc.com/upload/public/pdf/source/20190822/C409519_958D92627C3266250A1BDC5F14ED599F.pdf; Supplier: LCSC; Lamp Holder Type: 3mm圆形灯头; Emitted Color: Yellow,Green-yellow; Power Dissipation: 60mW; Forward Current: 20mA; Dominant Wavelength: 573nm；589nm; Peak Wavelength: 575nm；591nm; Diode Configuration: Common anode; Lens Color: 雾状白透镜; Viewing Angle: 50°; Operating Temperature: -40℃~+85℃
SW1 = HB-PH3-25414PB2GOP: Pin Structure:1x4P Pitch:2.54mm Row Spacing:2.54mm Circluar Pins/Square Pins:Square Pins Mounting Type:Straight Number of Rows:Plugin Number of Pins:4P Current Rating (Max):3A Voltage Rating (Max):250V Length of Mating Pin:6mm Insulation Height:2.54mm Len; LCSC Part Name: 间距:2.54mm 1x4P 直插 方针; Supplier Part: C6332197; Manufacturer: HANBO(汉博); Supplier Footprint: 插件,P=2.54mm; JLCPCB Part Class: Extended Part; Datasheet: https://atta.szlcsc.com/upload/public/pdf/source/20230803/F72D259687963761DF1B552F3BB84A31.pdf; Supplier: LCSC; Pin Structure: 1x4P; Pitch: 2.54mm; Row Spacing: 2.54mm; Circluar Pins/Square Pins: Square Pins; Mounting Type: Straight; Number of Rows: Plugin; Number of Pins: 4P; Current Rating (Max): 3A; Voltage Rating (Max): 250V; Length of Mating Pin: 6mm; Insulation Height: 2.54mm; Length of End Connection Pin: 3mm; Contact Plating: Gold; Operating Temperature Range: -40℃~+105℃; Soldering Temperature(Max): 260℃; Color: Black
U17 = STM32H743VIT6: CPU Core:ARM-MSeries GPIO Ports Number:82 Operating Voltage Range:1.71V~3.6V Operating Voltage Range:1.71V~3.6V CPU Maximum Speed:480MHz Operating Temperature Range:-40℃~+85℃ Operating Temperature Range:-40℃~+85℃ ADC (Bit):16bit DAC (Bit):12bit Universal; Supplier Part: C529058; Manufacturer: ST(意法半导体); Supplier Footprint: LQFP-100(14x14); JLCPCB Part Class: Extended Part; Datasheet: https://atta.szlcsc.com/upload/public/pdf/source/20200508/C529058_DA70143F266D6D825C3A912656F12A87.pdf; Supplier: LCSC; CPU Core: ARM-MSeries; GPIO Ports Number: 82; Operating Voltage Range: 1.71V~3.6V; CPU Maximum Speed: 480MHz; Operating Temperature Range: -40℃~+85℃; ADC (Bit): 16bit; DAC (Bit): 12bit; Universal Serial Bus: 有; Secure Digital Input and Output: 有; Direct Memory Access: 有
B1 = MB110S: Forward Voltage (Vf@If):900mV@1A Reverse Voltage (Vr): Average Rectified Current (Io): Reverse Leakage Current (Ir):100uA@100V Peak Forward Surge Current: Operating Temperature:-55℃~+150℃@(Tj) Operating Temperature:-55℃~+150℃@(Tj); LCSC Part Name: 电压:100V 电流:1A; Supplier Part: C94545; Manufacturer: MDD(辰达半导体); Supplier Footprint: MBS; JLCPCB Part Class: Extended Part; Datasheet: https://atta.szlcsc.com/upload/public/pdf/source/20230823/CF8E6B9D12CAED444661F971FB52D378.pdf; Supplier: LCSC; Forward Voltage (Vf@If): 900mV@1A; Reverse Leakage Current (Ir): 100uA@100V; Operating Temperature: -55℃~+150℃@(Tj)
C1-C4 C240 = 860020773013: Supplier Part: C7046938; Manufacturer: Wurth(伍尔特); Supplier Footprint: 插件; JLCPCB Part Class: Extended Part; Datasheet: https://atta.szlcsc.com/upload/public/pdf/source/20231023/860020773013.pdf-ae4cc118506be8cf0bae152b6102cbee.pdf; Supplier: LCSC
C5 C48 = CL10C101JB8NNNC: Capacitance: Tolerance:±5% Tolerance:±5% Voltage Rated: Temperature Coefficient:; LCSC Part Name: 100pF ±5% 50V; Supplier Part: C14858; Manufacturer: SAMSUNG(三星); Supplier Footprint: 0603; JLCPCB Part Class: Basic Part; Datasheet: https://atta.szlcsc.com/upload/public/pdf/source/20160218/1457707763339.pdf; Supplier: LCSC; Tolerance: ±5%
C6 = GRM1885C1H222JA01D: Capacitance: Tolerance:±5% Tolerance:±5% Voltage Rated: Temperature Coefficient:; LCSC Part Name: 2.2nF ±5% 50V; Supplier Part: C77033; Manufacturer: muRata(村田); Supplier Footprint: 0603; JLCPCB Part Class: Extended Part; Datasheet: https://atta.szlcsc.com/upload/public/pdf/source/20200305/C490387_23319AE8C154DEB24C505E6C82A8106A.pdf; Supplier: LCSC; Tolerance: ±5%
C7 = 6.3YXS1000MEFC8X11.5: Capacitance: Tolerance:±20% Tolerance:±20% Rated Voltage: Ripple Current:438mA@120Hz Equivalent Series Resistance(ESR):- Lead Spacing: φD: L: Lifetime @ Temp:4000hrs@105℃ Operating Temperature:-40℃~+105℃ Operating Temperature:-40℃~+105℃; LCSC Part Name: 1000uF ±20% 6.3V; Supplier Part: C5115430; Manufacturer: rubycon(红宝石); Supplier Footprint: 插件,D8xL11.5mm; JLCPCB Part Class: Extended Part; Datasheet: https://atta.szlcsc.com/upload/public/pdf/source/20221128/8AD20EA7405F8C40BF758105C4820F47.pdf; Supplier: LCSC; Tolerance: ±20%; Ripple Current: 438mA@120Hz; Lifetime @ Temp: 4000hrs@105℃; Operating Temperature: -40℃~+105℃
DP1 = MCP4017T-503E/LT: Resistance Value (Ohms):50kΩ Number of Taps:128 Interface Type:I2C Number of Channels:1 Supply Voltage:1.8V~5.5V Supply Voltage:1.8V~5.5V Precision:±20% Precision:±20% Temperature Coefficient (Typ):150ppm/℃ Temperature Coefficient (Typ):150ppm/℃ Operating; Supplier Part: C478095; Manufacturer: MICROCHIP(美国微芯); Supplier Footprint: SC-70-6; JLCPCB Part Class: Extended Part; Datasheet: https://atta.szlcsc.com/upload/public/pdf/source/20171212/C145561_15130636359521177681.pdf; Supplier: LCSC; Resistance Value (Ohms): 50kΩ; Number of Taps: 128; Interface Type: I2C; Number of Channels: 1; Supply Voltage: 1.8V~5.5V; Precision: ±20%; Temperature Coefficient (Typ): 150ppm/℃; Operating Temperature: -40℃~+125℃
R3 R4 = RC0603FR-0712RL: Type:Thick Film Resistors Resistance: Tolerance:±1% Tolerance:±1% Power(Watts): Overload Voltage (Max): Temperature Coefficient:±100ppm/℃ Temperature Coefficient:±100ppm/℃ Operating Temperature Range:-55℃~+155℃ Operating Temperature Range:-55℃~+155℃; LCSC Part Name: 厚膜电阻 12Ω ±1% 100mW; Supplier Part: C245909; Manufacturer: YAGEO(国巨); Supplier Footprint: 0603; JLCPCB Part Class: Extended Part; Datasheet: https://atta.szlcsc.com/upload/public/pdf/source/20181031/C326976_E9901E35333D136A19B6CE377E889A82.pdf; Supplier: LCSC; Type: Thick Film Resistors; Tolerance: ±1%; Temperature Coefficient: ±100ppm/℃; Operating Temperature Range: -55℃~+155℃
R5 R6 = AS05W2J0682T5E: Type:Thick Film Resistors Resistance:6.8kΩ Tolerance:±5% Tolerance:±5% Power(Watts): Overload Voltage (Max): Temperature Coefficient:±100ppm/℃ Temperature Coefficient:±100ppm/℃ Operating Temperature Range:-55℃~+155℃ Operating Temperature Range:-55℃~+155℃; LCSC Part Name: 6.8kΩ ±5% 500mW 厚膜电阻; Supplier Part: C560550; Manufacturer: UNI-ROYAL(厚声); Supplier Footprint: 0805; JLCPCB Part Class: Extended Part; Datasheet: https://atta.szlcsc.com/upload/public/pdf/source/20200723/C560412_34ABBCC623B52ADD707B94178459E29E.pdf; Supplier: LCSC; Type: Thick Film Resistors; Tolerance: ±5%; Temperature Coefficient: ±100ppm/℃; Operating Temperature Range: -55℃~+155℃
U1 = LME49721MA/NOPB: Type of Power Amplifier: Speaker Channels:双声道 Output Power: Supply Voltage:- Supply Voltage:- Operating Temperature:-40℃~+85℃ Operating Temperature:-40℃~+85℃; Supplier Part: C1348133; Manufacturer: TI(德州仪器); Supplier Footprint: SOIC-8; JLCPCB Part Class: Extended Part; Datasheet: https://www.ti.com/cn/lit/gpn/lme49721; Supplier: LCSC; Speaker Channels: 双声道; Operating Temperature: -40℃~+85℃
XLR1 = NC3FAAV1: Connector Type:XLR母插座 Current Rating (Max):- Operating Temperature Range:- Operating Temperature Range:-; Supplier Part: C368513; Manufacturer: NEUTRIK(优曲克); Supplier Footprint: 插件; JLCPCB Part Class: Extended Part; Datasheet: https://atta.szlcsc.com/upload/public/pdf/source/20190222/C368513_3D2EA58256C0ABD92AA33704412093B5.pdf; Supplier: LCSC; Connector Type: XLR母插座
C198 = 25PK1000MEFC10*16: Capacitance: Tolerance:±20% Tolerance:±20% Rated Voltage: Ripple Current:870mA@120Hz Equivalent Series Resistance(ESR):- Lead Spacing: φD: L: Lifetime @ Temp:2000hrs@85℃ Operating Temperature:-25℃~+85℃ Operating Temperature:-25℃~+85℃; LCSC Part Name: 1000uF ±20% 25V; Supplier Part: C109451; Manufacturer: rubycon(红宝石); Supplier Footprint: 插件,D10xL16mm; JLCPCB Part Class: Extended Part; Datasheet: https://atta.szlcsc.com/upload/public/pdf/source/20170428/1493376785021.pdf; Supplier: LCSC; Tolerance: ±20%; Ripple Current: 870mA@120Hz; Lifetime @ Temp: 2000hrs@85℃; Operating Temperature: -25℃~+85℃
C212 = HMK325C7475KN-TE: Capacitance: Tolerance:±10% Tolerance:±10% Voltage Rated: Temperature Coefficient:; LCSC Part Name: 4.7uF ±10% 100V; Supplier Part: C697607; Manufacturer: TAIYO YUDEN(太诱); Supplier Footprint: 1210; JLCPCB Part Class: Extended Part; Datasheet: https://atta.szlcsc.com/upload/public/pdf/source/20230919/4C0BA0F32796DDDB75EF7805C9FE5FCD.pdf; Supplier: LCSC; Tolerance: ±10%
D3 = SS34_C8678: Diode Configuration:Single Forward Voltage (Vf@If):550mV@3A Reverse Voltage (Vr):40V Average Rectified Current (Io):3A Reverse Leakage Current (Ir):500uA@40V; LCSC Part Name: 电压:40V 电流:3A; Supplier Part: C8678; Manufacturer: MDD; Supplier Footprint: SMA(DO-214AC); JLCPCB Part Class: Basic Part; Datasheet: https://atta.szlcsc.com/upload/public/pdf/source/20230314/A80AE34493C69B89E2F4B1712F433538.pdf; Supplier: LCSC; Diode Configuration: Single; Forward Voltage (Vf@If): 550mV@3A; Reverse Voltage (Vr): 40V; Average Rectified Current (Io): 3A; Reverse Leakage Current (Ir): 500uA@40V
D4 = PMEG6010CEJ,115: Forward Voltage (Vf@If):660mV@1A Reverse Voltage (Vr):60V Average Rectified Current (Io):1A Reverse Leakage Current (Ir):50uA@60V; LCSC Part Name: 电压:60V 电流:1A; Supplier Part: C406049; Manufacturer: Nexperia(安世); Supplier Footprint: SOD-323F; JLCPCB Part Class: Extended Part; Datasheet: https://atta.szlcsc.com/upload/public/pdf/source/20190722/C406049_D520AD27AC3A62FB86FDAB3C40EFF928.pdf; Supplier: LCSC; Forward Voltage (Vf@If): 660mV@1A; Reverse Voltage (Vr): 60V; Average Rectified Current (Io): 1A; Reverse Leakage Current (Ir): 50uA@60V
L1 = 0630CDMCDDS-4R7MC: Inductance: Tolerance:±20% Tolerance:±20% Rated Current: Saturation Current (Isat):6.8A DC Resistance (DCR): Type:- Ratings:-; LCSC Part Name: 4.7uH ±20% 6.8A; Supplier Part: C2453469; Manufacturer: Sumida(胜美达); Supplier Footprint: SMD,7x6.6mm; JLCPCB Part Class: Extended Part; Datasheet: https://atta.szlcsc.com/upload/public/pdf/source/20200309/C492723_5B4769124B99343D76BBAFA56B014E05.pdf; Supplier: LCSC; Tolerance: ±20%; Saturation Current (Isat): 6.8A
L2 = BMRA000606306R8MA1: Inductance: Tolerance:±20% Tolerance:±20% Rated Current: Saturation Current (Isat):8A DC Resistance (DCR): Type:屏蔽电感 Ratings:-; LCSC Part Name: 6.8uH ±20% 8A; Supplier Part: C2838323; Manufacturer: chilisin(奇力新); Supplier Footprint: SMD,6.6x7.3mm; JLCPCB Part Class: Extended Part; Datasheet: https://atta.szlcsc.com/upload/public/pdf/source/20201014/C882054_13A9FAE734A23C1BA894A547D6066DD3.pdf; Supplier: LCSC; Tolerance: ±20%; Saturation Current (Isat): 8A; Type: 屏蔽电感
POE_MODULE1 = DP9700 at-12V2A: LCSC Part Name: 25.5W POE模块（隔离型）; Supplier Part: C5380092; Manufacturer: SDAPO(达普); JLCPCB Part Class: Extended Part; Datasheet: https://atta.szlcsc.com/upload/public/pdf/source/20230403/873A7AE8DDB76A9EA934D268F11FD383.pdf; Supplier: LCSC
PWR_EXT1 = ZX-XH2.54-2PZZ: Pins Structure:1x2P Pitch:2.54mm Mounting Style:Straight Reference Series:XH Number of Pins:2P Number of Rows:1 Number of PINs Per Row:2 Row Spacing:- Current Rating (Max):3A Contact Material:Brass Contact Plating:Tin Operating Temperature Range:-25℃~+85℃; Supplier Part: C7429632; Manufacturer: Megastar(兆星); Supplier Footprint: 插件,P=2.54mm; JLCPCB Part Class: Extended Part; Datasheet: https://atta.szlcsc.com/upload/public/pdf/source/20230619/19BA6947230AA44A04D3EDD65E618FD0.pdf; Supplier: LCSC; Pins Structure: 1x2P; Pitch: 2.54mm; Mounting Style: Straight; Reference Series: XH; Number of Pins: 2P; Number of Rows: 1; Number of PINs Per Row: 2; Current Rating (Max): 3A; Contact Material: Brass; Contact Plating: Tin; Operating Temperature Range: -25℃~+85℃
R124 = 0603WAF4702T5E: Type:Thick Film Resistors Resistance:47kΩ Tolerance:±1% Tolerance:±1% Power(Watts): Overload Voltage (Max): Temperature Coefficient:±100ppm/℃ Temperature Coefficient:±100ppm/℃ Operating Temperature Range:-55℃~+155℃ Operating Temperature Range:-55℃~+155℃; LCSC Part Name: 47kΩ ±1% 100mW 厚膜电阻; Supplier Part: C25819; Manufacturer: UNI-ROYAL(厚声); Supplier Footprint: 0603; JLCPCB Part Class: Basic Part; Datasheet: https://atta.szlcsc.com/upload/public/pdf/source/20200306/C422600_1E6D84923E4A46A82E41ADD87F860B5C.pdf; Supplier: LCSC; Type: Thick Film Resistors; Tolerance: ±1%; Temperature Coefficient: ±100ppm/℃; Operating Temperature Range: -55℃~+155℃
R125 = 0603WAF1004T5E: Type:Thick Film Resistors Resistance:1MΩ Tolerance:±1% Tolerance:±1% Power(Watts): Overload Voltage (Max): Temperature Coefficient:±100ppm/℃ Temperature Coefficient:±100ppm/℃ Operating Temperature Range:-55℃~+155℃ Operating Temperature Range:-55℃~+155℃; LCSC Part Name: 1MΩ ±1% 100mW 厚膜电阻; Supplier Part: C22935; Manufacturer: UNI-ROYAL(厚声); Supplier Footprint: 0603; JLCPCB Part Class: Basic Part; Datasheet: https://atta.szlcsc.com/upload/public/pdf/source/20200306/C422600_1E6D84923E4A46A82E41ADD87F860B5C.pdf; Supplier: LCSC; Type: Thick Film Resistors; Tolerance: ±1%; Temperature Coefficient: ±100ppm/℃; Operating Temperature Range: -55℃~+155℃
R126 = 0603WAF3482T5E: Type:Thick Film Resistors Resistance:34.8kΩ Tolerance:±1% Tolerance:±1% Power(Watts): Overload Voltage (Max): Temperature Coefficient:±100ppm/℃ Temperature Coefficient:±100ppm/℃ Operating Temperature Range:-55℃~+155℃ Operating Temperature Range:-55℃~+155℃; LCSC Part Name: 34.8kΩ ±1% 100mW 厚膜电阻; Supplier Part: C23141; Manufacturer: UNI-ROYAL(厚声); Supplier Footprint: 0603; JLCPCB Part Class: Extended Part; Datasheet: https://atta.szlcsc.com/upload/public/pdf/source/20200306/C422600_1E6D84923E4A46A82E41ADD87F860B5C.pdf; Supplier: LCSC; Type: Thick Film Resistors; Tolerance: ±1%; Temperature Coefficient: ±100ppm/℃; Operating Temperature Range: -55℃~+155℃
U18 = AP62300WU-7: Function:Step-down type Output Type:Adjustable Input Voltage:4.2V~18V Input Voltage:4.2V~18V Output Voltage:800mV~7V Output Voltage:800mV~7V Output Current (Max):3A Switching Frequency:750kHz Operating Temperature:-40℃~+85℃@(TA) Operating Temperature:-40℃; Supplier Part: C1880390; Manufacturer: DIODES(美台); Supplier Footprint: TSOT-23-6; JLCPCB Part Class: Extended Part; Datasheet: https://atta.szlcsc.com/upload/public/pdf/source/20221028/76FC231195B26EEAF8CA165FB3593268.pdf; Supplier: LCSC; Function: Step-down type; Output Type: Adjustable; Input Voltage: 4.2V~18V; Output Voltage: 800mV~7V; Output Current (Max): 3A; Switching Frequency: 750kHz; Operating Temperature: -40℃~+85℃@(TA); Synchronous Rectification: Yes; Number of Outputs: 1; Topology: Step-down; Switch tube (built-in/external): 内置
U19 U20 = LD39200PUR: Output Type:可调 Maximum Input Voltage:6V Output Voltage:500mV~5.75V Output Voltage:500mV~5.75V MAX Output Current:2A Dropout Voltage:250mV@(2A) standby current:300uA Operating Temperature:-40℃~+125℃@(Tj) Operating Temperature:-40℃~+125℃@(Tj) Output Polarit; Supplier Part: C2969757; Manufacturer: ST(意法半导体); Supplier Footprint: DFN-6(3x3); JLCPCB Part Class: Extended Part; Datasheet: https://atta.szlcsc.com/upload/public/pdf/source/20221107/39B3427E03112C9DD294DB41D502BD53.pdf; Supplier: LCSC; Output Type: 可调; Maximum Input Voltage: 6V; Output Voltage: 500mV~5.75V; MAX Output Current: 2A; Dropout Voltage: 250mV@(2A); standby current: 300uA; Operating Temperature: -40℃~+125℃@(Tj); Output Polarity: Positive electrode; Number of Outputs: 1
U21 = LT8330ES6#TRPBF: Function:boost converterType；Buck-boost type Output Type:Adjustable Input Voltage:3V~40V Input Voltage:3V~40V Output Voltage:-800mV~60V；1.6V Output Voltage:-800mV~60V；1.6V Output Current (Max):1A Switching Frequency:2MHz Operating Temperature:-40℃~+125℃@(; Supplier Part: C673741; Manufacturer: ADI(亚德诺); Supplier Footprint: TSOT-23-6; JLCPCB Part Class: Extended Part; Datasheet: https://atta.szlcsc.com/upload/public/pdf/source/20210413/C673741_5EE91432BEBA6B95221844DEE374A594.pdf; Supplier: LCSC; Function: boost converterType；Buck-boost type; Output Type: Adjustable; Input Voltage: 3V~40V; Output Voltage: -800mV~60V；1.6V; Output Current (Max): 1A; Switching Frequency: 2MHz; Operating Temperature: -40℃~+125℃@(TJ); Synchronous Rectification: NO; Number of Outputs: 1; Topology: SEPIC；Boost; Switch tube (built-in/external): 内置

## Nets
12V: C192.2 C198.1 C207.2 C208.2 C210.2 D3.1(K) L2.1 POE_MODULE1.8(+12VDC) U18.3(VIN) U21.4(EN/UVLO) U21.6(VIN)
A3V3: B1.3(+) C9.2 C10.2 C204.1 R10.1 U1.8(VDD) U20.1(OUT) U20.2(ADJ/sense) ; also on sheet 6 7 8 9 10 11 12 13
A48V: C240.1 L5.2 ; also on sheet 13
D3V3: C11.2 C184.1 C185.1 C202.1 C218.2 C223.2 C224.1 C225.2 C230.2 C231.2 C232.2 C233.2 C234.2 C235.2 C236.2 DP1.1(VDD) L4.2 R84.2 R85.2 R135.2 R136.2 R137.2 R138.2 R140.2 R147.2 STATUS1.2 SW1.2 U16.1(VDD) U16.7(VDDO) U17.6(VBAT) U17.11(VDD) U17.20(VREF+) U17.21(VDDA) U17.27(VDD) U17.50(VDD) U17.75(VDD) U17.100(VDD) U19.1(OUT) U19.2(ADJ/sense) U22.9(VDDIO) ; also on sheet 6 7 8 9 10 11 12 13
GND: B1.4(-) C8.1 C9.1 C10.1 C11.1 C184.2 C185.2 C192.1 C194.1 C195.1 C196.1 C197.1 C198.2 C201.2 C202.2 C203.2 C204.2 C206.1 C207.1 C208.1 C210.1 C212.1 C214.1 C215.2 C216.1 C217.1 C218.1 C219.1 C220.1 C221.2 C223.1 C224.2 C225.1 C228.2 C229.2 C230.1 C231.1 C232.1 C233.1 C234.1 C235.1 C236.1 C237.1 C240.2 C241.2 C242.2 DP1.2(VSS) LED_PH1.1(K) LED_PH2.1(K) POE_MODULE1.7(-12VDC) PWR_EXT1.1 R9.2 R123.2 R126.1 R131.2 R134.2 R142.2 R143.2 R145.2 R146.2 R150.2 R151.2 R152.2 SW1.1 U1.4(VSS) U16.8(GND) U17.10(VSS) U17.19(VSSA) U17.26(VSS) U17.49(VSS) U17.74(VSS) U17.99(VSS) U18.1(GND) U19.3(GND) U19.7(EP) U20.3(GND) U20.7(EP) U21.2(GND) U22.25(EP) X1.2(GND) X1.4(GND) X2.2(GND) X2.4(GND) XLR1.1 ; also on sheet 6 7 8 9 10 11 12 13
VINT: C194.2 C195.2 C196.2 C197.2 C203.1 L1.2 R124.2 U19.5(EN) U19.6(IN) U20.5(EN) U20.6(IN)
ADC1+: C4.2 ; also on sheet 13
ADC1-: C3.2 ; also on sheet 13
ADC_TDM: R150.1 U17.5(PE6) ; also on sheet 13
ADCRESET: U17.88(PD7) ; also on sheet 13
BCK: R151.1 U16.9(CLK1) U17.4(PE5) ; also on sheet 13
ETH_CRS_DV: R141.1 U17.31(PA7)
ETH_MDC: U17.16(PC1) U22.13(MDC)
ETH_MDIO: R135.1 U17.24(PA2) U22.12(MDIO)
ETH_REFCLK: R139.1 U17.23(PA1)
ETH_RST: U17.30(PA6) U22.15(nRST)
ETH_RXD0: R132.2 U17.32(PC4)
ETH_RXD1: R133.2 U17.33(PC5)
ETH_TXD0: U17.51(PB12) U22.17(TXD0)
ETH_TXD1: U17.52(PB13) U22.18(TXD1)
ETH_TXEN: U17.47(PB11) U22.16(TXEN)
FS: R152.1 U16.10(CLK0) U17.3(PE4) ; also on sheet 13
GLED: LED1.2(+) R144.1 U22.2(LED2/nINT/nPME/nINTSEL)
LED1: R120.2 U17.25(PA3)
LED2: R121.2 U17.22(PA0)
LED3: R149.2 U17.53(PB14)
LED4: R148.2 U17.54(PB15)
PH1-4: R5.1 R6.2 ; also on sheet 6 7 8 13
RJ45_4+5: POE_MODULE1.3(VB1) RJ45.4 RJ45.5
RJ45_7+8: POE_MODULE1.4(VB2) RJ45.1 RJ45.2
RX: U17.37(PE7)
SCL: U16.4(SCL) U17.67(PA8) ; also on sheet 13
SCL1: DP1.3(SCL) R85.1 ; also on sheet 13
SDA: U16.5(SDA) U17.66(PC9) ; also on sheet 13
SDA1: DP1.4(SDA) R84.1 ; also on sheet 13
SWCLK: R146.1 SW1.3 U17.76(PA14)
SWDIO: R147.1 SW1.4 U17.72(PA13)
TR_1/2MID: L3.10(RX-CT) POE_MODULE1.1(VA1)
TR_3/6MID: L3.15(TX-CT) POE_MODULE1.2(VA2)
TX: U17.38(PE8)
XTAL1: C221.1 U22.5(XTAL1/CLKIN) X2.1(OSC1)
XTAL2: C219.2 U22.4(XTAL2) X2.3(OSC2)
YLED: LED2.2(+) U22.3(LED1/nINT/nPME/REGOFF)
$2N552: D3.2(A) PWR_EXT1.2
$2N1137: C193.2 L1.1 U18.2(SW)
$2N1140: C193.1 U18.6(BST)
$2N1141: R123.1 R124.1 U18.4(FB)
$2N1149: C201.1 U18.5(EN)
$2N8927: C206.2 U21.5(INTVCC)
$2N8934: D4.2(A) L2.2 U21.1(SW)
$2N8937: C211.1 R125.1 R126.2 U21.3(FBX)
$2N8938: C211.2 C212.2 C241.1 C242.1 D4.1(C) L5.1 R125.2
$3N2087: R145.1 U17.94(BOOT0)
$3N2106: C237.2 U17.14(NRST)
$3N2132: C229.1 U17.73(VCAP)
$3N2133: C228.1 U17.48(VCAP)
$3N2146: R149.1 STATUS1.1
$3N2149: R148.1 STATUS1.3
$3N11430: LED_PH1.2(A) R120.1
$3N11431: LED_PH2.2(A) R121.1
$4N1912: L3.9(RX-) RJ45.8
$4N1913: L3.11(RX+) RJ45.7
$4N1916: L3.14(TX-) RJ45.6
$4N1917: L3.16(TX+) RJ45.3
$4N1918: D5.2(K) L3.1(TD+) R128.1 U22.21(TXP)
$4N1919: D5.1(K) L3.3(TD-) R127.1 U22.20(TXN)
$4N1920: D6.1(K) L3.8(RD-) R129.1 U22.22(RXN)
$4N1922: D6.2(K) L3.6(RD+) R130.1 U22.23(RXP)
$4N1927: R131.1 U22.24(RBIAS)
$4N1929: C214.2 C215.1 C217.2 L3.2(TD-CT) L3.7(RD-CT) L4.1 R127.2 R128.2 R129.2 R130.2 U22.1(VDD2A) U22.19(VDD1A)
$4N1934: R134.1 U22.10(RXER/PHYAD0)
$4N1936: R133.1 R136.1 U22.7(RXD1/MODE1)
$4N1937: R132.1 R137.1 U22.8(RXD0/MODE0)
$4N1948: C216.2 C220.2 U22.6(VDDCR)
$4N1949: R138.1 R139.2 U22.14(nINT/REFCLKO)
$4N1957: R140.1 R141.2 U22.11(CRS_DV/MODE2)
$4N1969: LED1.1(-) R142.1 R144.2
$4N1970: LED2.1(-) R143.1
$5N3807: U16.3(XB) X1.3(OSC2)
$5N3810: U16.2(XA) X1.1(OSC1)
$6N1968: C4.1 C48.2 R2.2 U1.7(OUT B)
$6N1989: C3.1 C5.2 R1.2 U1.1(OUT A)
$6N2290: C48.1 DP1.6(W) R2.1 U1.6(IN B-)
$6N2380: C7.2 DP1.5(B)
$6N2424: C5.1 C7.1 R1.1 U1.2(IN A-)
$6N2717: C8.2 R7.1 R8.2 R9.1 R10.2
$6N2736: B1.2(AC) C1.2 R3.1
$6N2751: B1.1(AC) C2.2 R4.1
$6N18329: C2.1 R5.2 XLR1.2
$6N18368: C1.1 R6.1 XLR1.3
$6N19149: C6.2 R3.2 R7.2 U1.3(IN A+)
$6N19153: C6.1 R4.2 R8.1 U1.5(IN B+)

Not connected (* = marked no-connect by the designer): D5 3(A)*; D6 3(A)*; L3 4(NC)* 5(NC)* 12(NC)* 13(NC)*; POE_MODULE1 5(NC)* 6(NC)* 9(NC)* 10(NC)*; U16 6(CLK2)*; U17 1(PE2)* 2(PE3)* 7(PC13)* 8(PC14-OSC32_IN)* 9(PC15-OSC32_OUT)* 12(PH0-OSC_IN)* 13(PH1-OSC_OUT)* 15(PC0)* 17(PC2_C)* 18(PC3_C)* 28(PA4)* 29(PA5)* 34(PB0)* 35(PB1)* 36(PB2)* 39(PE9)* 40(PE10)* 41(PE11)* 42(PE12)* 43(PE13)* 44(PE14)* 45(PE15)* 46(PB10)* 55(PD8)* 56(PD9)* 57(PD10)* 58(PD11)* 59(PD12)* 60(PD13)* 61(PD14)* 62(PD15)* 63(PC6)* 64(PC7)* 65(PC8)* 68(PA9)* 69(PA10)* 70(PA11)* 71(PA12)* 77(PA15)* 78(PC10)* 79(PC11)* 80(PC12)* 81(PD0)* 82(PD1)* 83(PD2)* 84(PD3) 85(PD4)* 86(PD5)* 87(PD6)* 89(PB3)* 90(PB4)* 91(PB5)* 92(PB6)* 93(PB7)* 95(PB8)* 96(PB9)* 97(PE0)* 98(PE1)*; U19 4(PG)*; U20 4(PG)*

## Notes on the sheets
sheet 4
- 0x60
